# EAGLE board PCB_ICBExt-R1.0-J23 (EAGLE 6.6.0), part 1 of 2
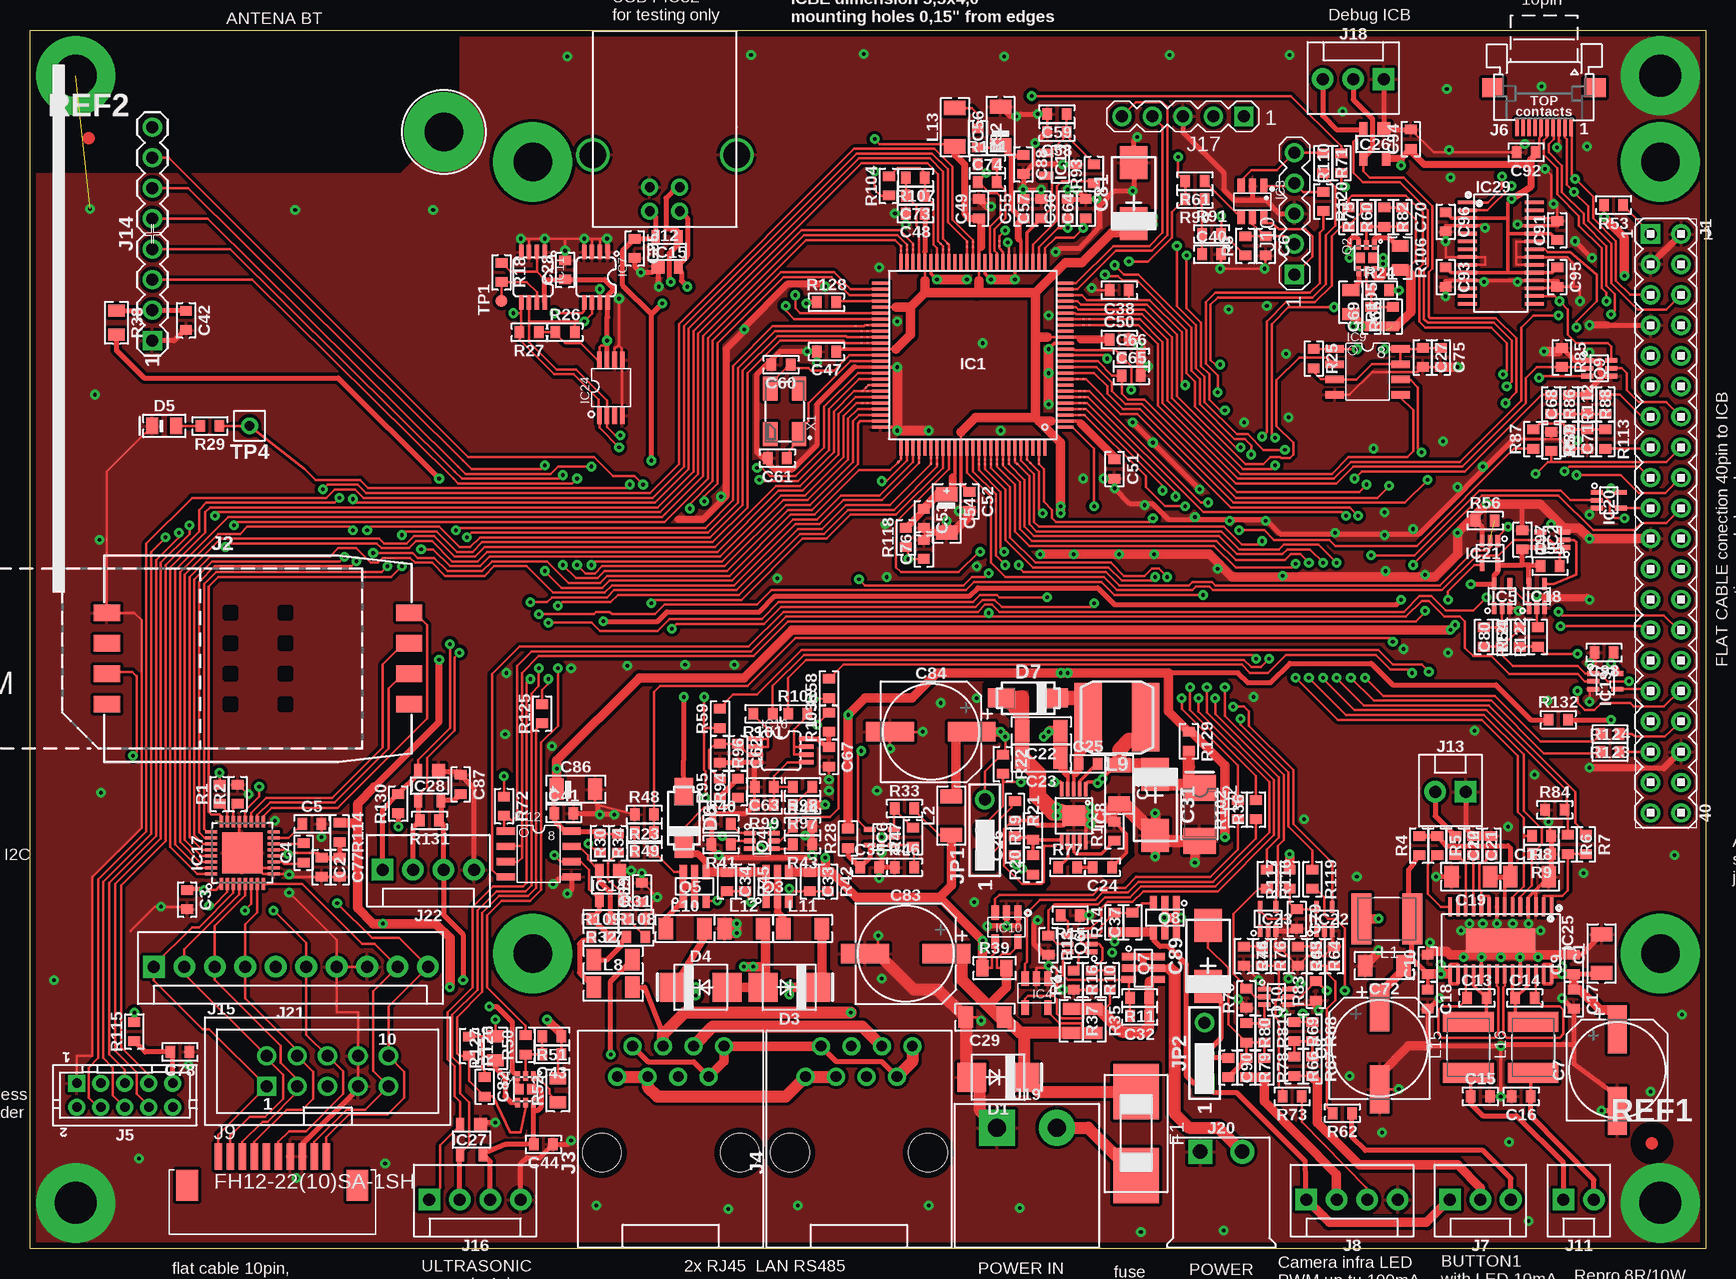
[diagram p7: board, top side]
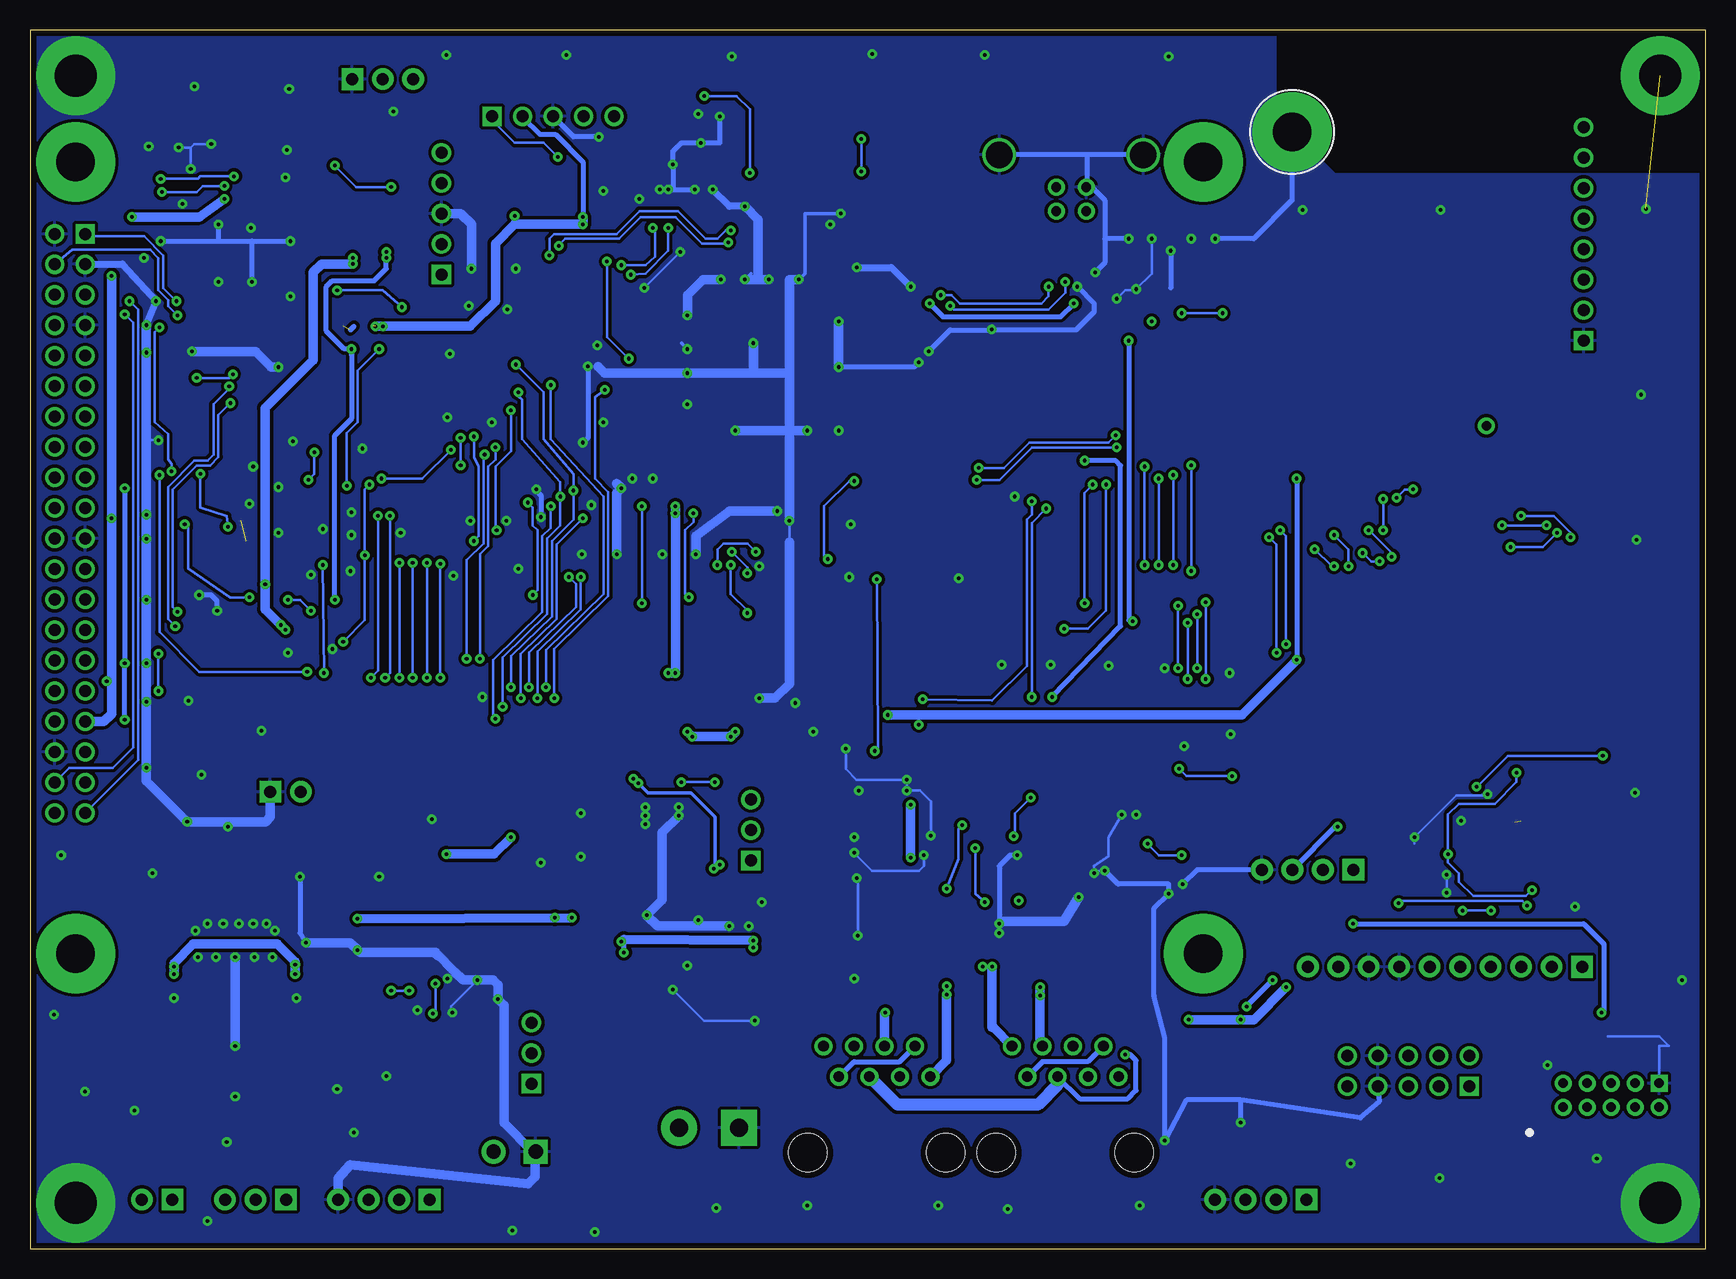
[diagram p8: board, bottom side, seen from below]

Size 139.7 x 101.6 mm. Coordinates in mm from the lower left corner, seen from the top.
Copper layers (1*16): Top 0.035mm / dielectric 1.5mm / Bottom 0.035mm
Design rules "default *": minimum track width 0.2mm, minimum drill 0.3mm, track to track 0.2mm, track to pad 0.2mm, pad to pad 0.2mm, via to via 0.2mm, smd to smd 0.001mm, copper to edge 0.49mm, drill to drill 0.2mm, minimum pad ring 0.3mm, minimum via ring 0.25mm, stop-mask expansion 0.1mm, vias tented up to drill 0.6mm, thermal gap 0.27mm
Net classes: 1 HV: clearance 0.3 mm to class 0
tRestrict: area 9.9,94.6 to 30.9,101.6; 34 lines
bRestrict: area 9.9,94.6 to 30.9,101.6

## Footprints (pad centres in the part's own frame; a part is rotated, then mirrored left to right if it is on the bottom)
1206 = smd 1.19 x 1.79: 1 -1.6,0; 2 1.6,0
0603 = smd 0.79 x 0.99: 1 -0.8,0; 2 0.8,0
CAP_8MM_DIA_SMT = smd 1.59 x 3.99: 1 0,3.4; 2 0,-3.4
CT-C = smd 2.743 x 2.311: + -2.54,0; - 2.54,0
1206-POL-C = smd 1.19 x 1.79: + -1.6,0; - 1.6,0
SMB = smd 2.4 x 2.4: A 2.2,0; C -2.2,0
SMA = smd 2.159 x 2.743: + -2.311,0.003; - 2.108,-0.002
0805-POL-D = smd 0.99 x 1.39: A 1,0; K -1,0
SMA' = smd 2.21 x 1.575: A -2.223,0; K 2.223,0
LITTLEFUSE0154 = smd 4.6 x 3.8: 1 3.5,0; 2 -3.5,0
TQFP100_14X14_0,5MM = smd 1.39 x 0.28: 1 -7.7,6; 2 -7.7,5.5; 3 -7.7,5; 4 -7.7,4.5; 5 -7.7,4; 6 -7.7,3.5; 7 -7.7,3; 8 -7.7,2.5; 9 -7.7,2; 10 -7.7,1.5; 11 -7.7,1; 12 -7.7,0.5; 13 -7.7,0; 14 -7.7,-0.5; 15 -7.7,-1; 16 -7.7,-1.5; 17 -7.7,-2; 18 -7.7,-2.5; 19 -7.7,-3; 20 -7.7,-3.5; 21 -7.7,-4; 22 -7.7,-4.5; 23 -7.7,-5; 24 -7.7,-5.5; 25 -7.7,-6; 51 7.7,-6; 52 7.7,-5.5; 53 7.7,-5; 54 7.7,-4.5; 55 7.7,-4; 56 7.7,-3.5; 57 7.7,-3; 58 7.7,-2.5; 59 7.7,-2; 60 7.7,-1.5; 61 7.7,-1; 62 7.7,-0.5; 63 7.7,0; 64 7.7,0.5; 65 7.7,1; 66 7.7,1.5; 67 7.7,2; 68 7.7,2.5; 69 7.7,3; 70 7.7,3.5; 71 7.7,4; 72 7.7,4.5; 73 7.7,5; 74 7.7,5.5; 75 7.7,6 | smd 0.28 x 1.39: 26 -6,-7.7; 27 -5.5,-7.7; 28 -5,-7.7; 29 -4.5,-7.7; 30 -4,-7.7; 31 -3.5,-7.7; 32 -3,-7.7; 33 -2.5,-7.7; 34 -2,-7.7; 35 -1.5,-7.7; 36 -1,-7.7; 37 -0.5,-7.7; 38 0,-7.7; 39 0.5,-7.7; 40 1,-7.7; 41 1.5,-7.7; 42 2,-7.7; 43 2.5,-7.7; 44 3,-7.7; 45 3.5,-7.7; 46 4,-7.7; 47 4.5,-7.7; 48 5,-7.7; 49 5.5,-7.7; 50 6,-7.7; 76 6,7.7; 77 5.5,7.7; 78 5,7.7; 79 4.5,7.7; 80 4,7.7; 81 3.5,7.7; 82 3,7.7; 83 2.5,7.7; 84 2,7.7; 85 1.5,7.7; 86 1,7.7; 87 0.5,7.7; 88 0,7.7; 89 -0.5,7.7; 90 -1,7.7; 91 -1.5,7.7; 92 -2,7.7; 93 -2.5,7.7; 94 -3,7.7; 95 -3.5,7.7; 96 -4,7.7; 97 -4.5,7.7; 98 -5,7.7; 99 -5.5,7.7; 100 -6,7.7
SC70-5,SOT353,TSSOP5 = smd 0.39 x 0.99: 1 -0.65,-1; 2 0,-1; 3 0.65,-1; 4 0.65,1; 5 -0.65,1
SOT23-6 = smd 0.6 x 1.2: 1 -0.95,-1.3; 2 0,-1.3; 3 0.95,-1.3; 4 0.95,1.3; 5 0.003,1.3; 6 -0.95,1.3
SOT23-5 = smd 0.6 x 1.2: 1 -0.95,-1.206; 2 0,-1.206; 3 0.95,-1.206; 4 0.95,1.206; 5 -0.95,1.206
SC-70-5 = smd 0.39 x 0.99: 1 -0.65,-1; 2 0,-1; 3 0.65,-1; 4 0.65,1; 5 -0.65,1
MSOP-08 = smd 0.38 x 1.2: 1 -1,-2.1; 2 -0.35,-2.1; 3 0.3,-2.1; 4 0.95,-2.1; 5 0.95,2.1; 6 0.3,2.1; 7 -0.35,2.1; 8 -1,2.1
MSOP10EXP = smd 0.3 x 1.2: 1 -1,-2.2; 2 -0.5,-2.2; 3 0,-2.2; 4 0.5,-2.2; 5 1,-2.2; 6 1,2.2; 7 0.5,2.2; 8 0,2.2; 9 -0.5,2.2; 10 -1,2.2 | smd 1.88 x 1.68: EP 0,0
SO-08 = smd 0.61 x 1.524: 1 -1.905,-2.743; 2 -0.635,-2.743; 3 0.635,-2.743; 4 1.905,-2.743; 5 1.905,2.743; 6 0.635,2.743; 7 -0.635,2.743; 8 -1.905,2.743
SO08 = smd 0.61 x 1.524: 1 -1.905,-2.743; 2 -0.635,-2.743; 3 0.635,-2.743; 4 1.905,-2.743; 5 1.905,2.743; 6 0.635,2.743; 7 -0.635,2.743; 8 -1.905,2.743
SOT23 = smd 0.69 x 1.19: 1 0.95,1.2; 2 -0.95,1.2; 3 0,-1.2
SOT-143 = smd 1.09 x 1.19: 1 -0.75,-1.2 | smd 0.69 x 1.19: 2 0.95,-1.2; 3 0.95,1.2; 4 -0.95,1.2
QFN32 = smd 0.99 x 0.28: 1 -2.6,1.75; 2 -2.6,1.25; 3 -2.6,0.75; 4 -2.6,0.25; 5 -2.6,-0.25; 6 -2.6,-0.75; 7 -2.6,-1.25; 8 -2.6,-1.75; 17 2.6,-1.75; 18 2.6,-1.25; 19 2.6,-0.75; 20 2.6,-0.25; 21 2.6,0.25; 22 2.6,0.75; 23 2.6,1.25; 24 2.6,1.75 | smd 0.28 x 0.99: 9 -1.75,-2.6; 10 -1.25,-2.6; 11 -0.75,-2.6; 12 -0.25,-2.6; 13 0.25,-2.6; 14 0.75,-2.6; 15 1.25,-2.6; 16 1.75,-2.6; 25 1.75,2.6; 26 1.25,2.6; 27 0.75,2.6; 28 0.25,2.6; 29 -0.25,2.6; 30 -0.75,2.6; 31 -1.25,2.6; 32 -1.75,2.6 | smd 3.4 x 3.4: PAD 0,0
TSSOP08-3 = smd 0.38 x 1.4: 1 -0.94,-2.343; 2 -0.305,-2.343; 3 0.33,-2.343; 4 0.965,-2.343; 5 0.965,2.292; 6 0.33,2.292; 7 -0.305,2.292; 8 -0.94,2.292
TSSOP28_EP = smd 1.59 x 0.3: 1 -2.8,4.225; 2 -2.8,3.575; 3 -2.8,2.925; 4 -2.8,2.275; 5 -2.8,1.625; 6 -2.8,0.975; 7 -2.8,0.325; 8 -2.8,-0.325; 9 -2.8,-0.975; 10 -2.8,-1.625; 11 -2.8,-2.275; 12 -2.8,-2.925; 13 -2.8,-3.575; 14 -2.8,-4.225; 15 2.8,-4.225; 16 2.8,-3.575; 17 2.8,-2.925; 18 2.8,-2.275; 19 2.8,-1.625; 20 2.8,-0.975; 21 2.8,-0.325; 22 2.8,0.325; 23 2.8,0.975; 24 2.8,1.625; 25 2.8,2.275; 26 2.8,2.925; 27 2.8,3.575; 28 2.8,4.225 | smd 1.99 x 5.79: EP 0,0
TSSOP28 = smd 1.59 x 0.3: 1 -2.8,4.225; 2 -2.8,3.575; 3 -2.8,2.925; 4 -2.8,2.275; 5 -2.8,1.625; 6 -2.8,0.975; 7 -2.8,0.325; 8 -2.8,-0.325; 9 -2.8,-0.975; 10 -2.8,-1.625; 11 -2.8,-2.275; 12 -2.8,-2.925; 13 -2.8,-3.575; 14 -2.8,-4.225; 15 2.8,-4.225; 16 2.8,-3.575; 17 2.8,-2.925; 18 2.8,-2.275; 19 2.8,-1.625; 20 2.8,-0.975; 21 2.8,-0.325; 22 2.8,0.325; 23 2.8,0.975; 24 2.8,1.625; 25 2.8,2.275; 26 2.8,2.925; 27 2.8,3.575; 28 2.8,4.225
MA20-2 = drill 1 pad 1.6 square: 1 -24.13,-1.27 | drill 1 pad 1.6: 2 -24.13,1.27; 3 -21.59,-1.27; 4 -21.59,1.27; 5 -19.05,-1.27; 6 -19.05,1.27; 7 -16.51,-1.27; 8 -16.51,1.27; 9 -13.97,-1.27; 10 -13.97,1.27; 11 -11.43,-1.27; 12 -11.43,1.27; 13 -8.89,-1.27; 14 -8.89,1.27; 15 -6.35,-1.27; 16 -6.35,1.27; 17 -3.81,-1.27; 18 -3.81,1.27; 19 -1.27,-1.27; 20 -1.27,1.27; 21 1.27,-1.27; 22 1.27,1.27; 23 3.81,-1.27; 24 3.81,1.27; 25 6.35,-1.27; 26 6.35,1.27; 27 8.89,-1.27; 28 8.89,1.27; 29 11.43,-1.27; 30 11.43,1.27; 31 13.97,-1.27; 32 13.97,1.27; 33 16.51,-1.27; 34 16.51,1.27; 35 19.05,-1.27; 36 19.05,1.27; 37 21.59,-1.27; 38 21.59,1.27; 39 24.13,-1.27; 40 24.13,1.27
CCM03-3504LFT-JK = smd 2.2 x 1.4: C1 12.6,3.81; C2 12.6,1.27; C3 12.6,-1.27; C4 12.6,-3.81; C5 -12.6,3.81; C6 -12.6,1.27; C7 -12.6,-1.27; C8 -12.6,-3.81
RJ8-8-90-DOWN = drill 0.9 pad 1.4: 1 -4.445,6.35; 2 -3.175,8.89; 3 -1.905,6.35; 4 -0.635,8.89; 5 0.635,6.35; 6 1.905,8.89; 7 3.175,6.35; 8 4.445,8.89 | hole 3.2: 5.75,0; -5.75,0
DF11-10DP-2DSA = drill 0.8 pad 1.3 square: 1 4,-1 | drill 0.8 pad 1.3: 2 4,1; 3 2,-1; 4 2,1; 5 0,-1; 6 0,1; 7 -2,-1; 8 -2,1; 9 -4,-1; 10 -4,1
FH12A-10S-05SH = smd 0.3 x 1.5: 1 -2.25,2.8; 2 -1.75,2.8; 3 -1.25,2.8; 4 -0.75,2.8; 5 -0.25,2.8; 6 0.25,2.8; 7 0.75,2.8; 8 1.25,2.8; 9 1.75,2.8; 10 2.25,2.8 | smd 1.8 x 1.6: C1 -4.25,-0.5; C2 4.25,-0.5
3-641215-3 = drill 1 pad 1.8 square: 1 2.54,0 | drill 1 pad 1.8: 2 0,0; 3 -2.54,0
3-641215-4 = drill 1 pad 1.8 square: 1 3.81,0 | drill 1 pad 1.8: 2 1.27,0; 3 -1.27,0; 4 -3.81,0
CON-FPC-1.0MM-10POS = smd 0.6 x 2.2: 1 -4.5,0; 2 -3.5,0; 3 -2.5,0; 4 -1.5,0; 5 -0.5,0; 6 0.5,0; 7 1.5,0; 8 2.5,0; 9 3.5,0; 10 4.5,0 | smd 1.8 x 2.6: P$1 -7.1,-2.4; P$2 7.1,-2.4
MA05-1 = drill 1 pad 1.6 square: 1 -5.08,0 | drill 1 pad 1.6: 2 -2.54,0; 3 0,0; 4 2.54,0; 5 5.08,0
3-641215-2 = drill 1 pad 1.8 square: 1 1.27,0 | drill 1 pad 1.8: 2 -1.27,0
USB_B_90 = drill 0.8 pad 1.4: 1_+5V 1.25,4.7; 2_D- -1.25,4.7; 3_D+ -1.25,2.7; 4_GND 1.25,2.7 | drill 2.2 pad 2.8: SH1 -6,0; SH2 6,0
MA08-1-MALE = drill 1 pad 1.6 square: 1 -8.89,0 | drill 1 pad 1.6: 2 -6.35,0; 3 -3.81,0; 4 -1.27,0; 5 1.27,0; 6 3.81,0; 7 6.35,0; 8 8.89,0
MLW10G-5X2 = drill 1 pad 1.6 square: 1 -5.08,-1.27 | drill 1 pad 1.6: 2 -5.08,1.27; 3 -2.54,-1.27; 4 -2.54,1.27; 5 0,-1.27; 6 0,1.27; 7 2.54,-1.27; 8 2.54,1.27; 9 5.08,-1.27; 10 5.08,1.27
796644-2-5MM = drill 1.5 pad 3 square: 1 2.5,0 | drill 1.5 pad 3: 2 -2.5,0
284512-2-3,5MM = drill 1.2 pad 2 square: 1 1.75,0 | drill 1.2 pad 2: 2 -1.75,0
4-641215-0 = drill 1 pad 1.8 square: 1 11.38,0 | drill 1 pad 1.8: 2 8.84,0; 3 6.3,0; 4 3.76,0; 5 1.22,0; 6 -1.32,0; 7 -3.86,0; 8 -6.4,0; 9 -8.94,0; 10 -11.48,0
JP3CLOSE12 = drill 1 pad 1.626 square: 1 -2.54,0 | drill 1 pad 1.626: 2 0,0; 3 2.54,0
L1812 = smd 1.66 x 4.22: 1 -2.12,0; 2 2.12,0
NR6028 = smd 2.3 x 5.7: 1 2.4,0; 2 -2.4,0
TEMP-PAD = smd 0.2 x 0.2: P$1 0,0
PCB-ICBE = drill 3.5 pad 6.6: 1 -3.01,-17.79; 2 -135.09,-17.79; 3 -135.09,76.19; 4 -3.01,76.19
PCB-ICB = drill 3.2 pad 6.6: 1 -3,3; 2 -97,3; 3 -97,69; 4 -3,69
BT_MODULE_BRD = drill 3.2 pad 6.6: 1 25.5,20.5
MICRO_FET = smd 0.4 x 0.8: 1 -0.65,-1.1; 2 0,-1.1; 3 0.65,-1.1; 4 0.65,1.1; 5 0,1.1; 6 -0.65,1.1 | smd 0.7 x 0.86: P1 -0.5,0; P2 0.5,0
SSOT-6 = smd 0.6 x 1.2: 1 -0.95,-1.2; 2 0,-1.2; 3 0.95,-1.206; 4 0.95,1.2; 5 0,1.2; 6 -0.95,1.2
SC70-6 = smd 0.39 x 0.99: 1 -0.65,-1; 2 0,-1; 3 0.65,-1; 4 0.65,1; 5 0,1; 6 -0.65,1
0805 = smd 0.99 x 1.39: 1 -1,0; 2 1,0
SMD_ROUND_1MM = smd 1 x 1: P$1 0,0
TH_ROUND_14MM08MM = drill 0.8 pad 1.4: P$1 0,0
7B = smd 2 x 1.2: 1 -1.9,-1.2; 2 1.9,-1.2; 3 1.9,1.2; 4 -1.9,1.2

## Placement (x,y rotation side)
C1  4u7/50  [1206]  131,24.6 90 top
C2  100n  [0603]  24.3,31.8 270 top
C3  10u  [0603]  13.1,29.1 270 top
C4  1u/10  [0603]  22.8,33 90 top
C5  4u7/6.3  [0603]  23.5,35.4 0 top
C6  10u  [0603]  103,83.6 270 top
C7  220u/25V  [CAP_8MM_DIA_SMT]  132.3,14.9 0 top
C8  220u/25V  [CAP_8MM_DIA_SMT]  112.5,16.7 0 top
C9  1n  [0603]  128.7,23.7 90 top
C10  1n  [0603]  116.5,23.7 90 top
C11  4u7/50  [1206]  125,31 0 top
C12  1u/25  [0603]  121.8,33.6 90 top
C13  470n  [0603]  120.6,20.9 0 top
C14  470n  [0603]  124.6,20.9 0 top
C15  1n  [0603]  120.9,12.7 0 top
C16  1n  [0603]  124.3,12.7 180 top
C17  100n  [0603]  128.7,20.8 270 top
C18  100n  [0603]  116.5,20.8 270 top
C19  4u7/50  [1206]  120.1,31 180 top
C20  1u/25  [0603]  118.8,33.6 270 top
C21  1u/25  [0603]  120.3,33.6 270 top
C22  4u7/50  [1206]  84.3,43.2 180 top
C23  4u7/50  [1206]  84.3,40.9 180 top
C24  1n  [0603]  89.4,31.8 180 top
C25  470n/25  [0603]  88.2,40.4 0 top
C26  10p  [0603]  82.1,33.6 90 top
C27  100n  [0603]  116.1,74.3 270 top
C28  100n  [0603]  44.6,81.6 90 top
C29  4u7/50  [1206]  79.6,19.3 180 top
C30  47u/6.3  [1206]  90.8,38.7 270 top
C31  47uTC  [CT-C]  93.8,37 270 top
C32  100n  [0603]  92.5,19.4 180 top
C33  100n  [0603]  65,30.6 270 top
C34  1n  [0603]  58.1,30.6 270 top
C35  1u  [0603]  70,31.8 0 top
C36  100n  [0603]  86.5,86.7 90 top
C37  1n  [0603]  91.9,27.2 90 top
C38  10n  [0603]  90.8,79.9 180 top
C39  100n  [0603]  51,29.7 90 top
C40  100n  [0603]  98.5,82.9 0 top
C41  100n  [0603]  44.5,36.3 0 top
C42  10u  [0603]  13,77.4 270 top
C43  1n  [0603]  43.5,16.2 180 top
C44  10u  [0603]  42.8,8.7 180 top
C45  100n  [0603]  105.7,24.4 270 top
C46  100n  [0603]  101.2,24.4 270 top
C47  100n  [0603]  66.4,74.8 180 top
C48  1u  [0603]  73.8,86.3 180 top
C49  100n  [0603]  79.1,86.7 90 top
C50  1u  [0603]  90.8,75.8 0 top
C51  100n  [0603]  90.4,65 270 top
C52  1u  [0603]  78.3,62.3 270 top
C53  10u  [0603]  74.5,60.9 270 top
C54  10uTA  [1206-POL-C]  76.4,61.3 270 top
C55  100n  [0603]  82.8,86.7 90 top
C56  10uTA  [1206-POL-C]  80.9,93.6 90 top
C57  10n  [0603]  84.3,86.7 90 top
C58  100n  [0603]  85.6,93.1 180 top
C59  100n  [0603]  85.6,94.6 180 top
C60  18p  [0603]  62.6,73.7 180 top
C61  18p  [0603]  62.3,65.9 180 top
C62  1n  [0603]  59,41.3 270 top
C63  1n  [0603]  61.2,38.5 180 top
C64  100n  [0603]  88,86.7 90 top
C65  1n  [0603]  91.8,72.8 0 top
C66  10n  [0603]  91.8,74.3 0 top
C67  10u  [0603]  66.6,41 270 top
C68  1n  [0603]  128.3,70.4 90 top
C69  1n  [0603]  111.8,77.7 90 top
C70  1n  [0603]  114.4,86 270 top
C71  1n  [0603]  128.3,67.5 270 top
C72  4u7/50  [1206]  112.9,23.6 180 top
C73  10n  [0603]  73.8,87.8 180 top
C74  10n  [0603]  79.8,88.9 0 top
C75  100n  [0603]  117.6,74.3 270 top
C76  10n  [0603]  74.5,58.3 90 top
C77  10u  [0603]  25.8,31.8 270 top
C78  10u  [0603]  12.5,16.4 180 top
C79  10u  [0603]  105.6,27.5 270 top
C80  10n  [0603]  122.7,51 90 top
C81  47uTC  [CT-C]  92,88 90 top
C82  1n  [0603]  37.9,13.5 270 top
C83  220u/25V  [CAP_8MM_DIA_SMT]  73,24.6 270 top
C84  220u/25V  [CAP_8MM_DIA_SMT]  75.1,43.1 270 top
C85  100n  [0603]  50.4,83.4 270 top
C86  10uTA  [1206-POL-C]  45.5,38.3 0 top
C87  10u  [0603]  35.9,38.7 270 top
C88  10u  [0603]  82.8,90.4 270 top
C89  47uTC  [CT-C]  98.2,24.4 90 top
C90  100n  [0603]  99.9,15.1 270 top
C91  10n  [0603]  127.3,84.9 90 top
C92  10u  [0603]  124.7,91.4 180 top
C93  100n  [0603]  118,81 270 top
C94  100n  [0603]  115.1,92.5 90 top
C95  10n  [0603]  127.3,81 270 top
C96  10n  [0603]  118,85.6 270 top
C97  1u  [0603]  124.4,59.1 270 top
C98  10u  [0603]  131.2,49.7 180 top
D1  P6SMB20A  [SMB]  80.7,14.3 180 top
D2  SMLVT3V3  [SMA]  97.5,36.1 270 top
D3  P6SMB20A  [SMB]  63.3,21.8 180 top
D4  P6SMB20A  [SMB]  55.9,21.8 0 top
D5  LED-GREEN  [0805-POL-D]  11.2,68.6 0 top
D6  SS14  [SMA']  54.5,35.9 270 top
D7  SS14  [SMA']  83.2,45.9 0 top
F1  T2A-LITTLEFUSE0154  [LITTLEFUSE0154]  92.2,9.6 270 top
IC1  PIC32MX470F512L-I/PF  [TQFP100_14X14_0,5MM]  78.6,74.5 180 top
IC2  AHC1G08  [SC70-5,SOT353,TSSOP5]  126.9,59.1 90 top
IC3  PIC10F200T-I/OT  [SOT23-6]  101.9,87.3 180 top
IC4  MAX9938HEUK+T  [SOT23-5]  83.9,21.3 180 top
IC5  AHC1G14  [SC70-5,SOT353,TSSOP5]  122.7,54.4 0 top
IC6  MIC841LYC  [SC-70-5]  71,34.3 90 top
IC7  24LC32A-I/MS  [MSOP-08]  47.15,81 180 top
IC8  LT3971EMSE  [MSOP10EXP]  87,36.1 180 top
IC9  AT25SF321-SSHD  [SO-08]  111.5,73.1 270 top
IC10  MAX9938HEUK+T  [SOT23-5]  81.4,26.8 180 top
IC11  24LC32A-I/MS  [MSOP-08]  41.9,81 180 top
IC12  SN65HVD12D  [SO08]  42.4,32.9 270 top
IC13  REF3025  [SOT23]  85.9,90.4 90 top
IC14  TPD2E001DZDR  [SOT-143]  48.4,30.3 180 top
IC15  TPD2E001DZDR  [SOT-143]  53.1,83.1 0 top
IC16  MCP6042-I/MS  [MSOP-08]  62.6,41.5 270 top
IC17  LTC1955  [QFN32]  17.7,33 90 top
IC18  AHC1G32  [SC70-5,SOT353,TSSOP5]  125.6,54.4 0 top
IC19  AHC1G08  [SC70-5,SOT353,TSSOP5]  131.3,47.3 270 top
IC20  AHC1G08  [SC70-5,SOT353,TSSOP5]  131.6,62.4 270 top
IC21  AHC1G32  [SC70-5,SOT353,TSSOP5]  121.7,58 180 top
IC22  AHC1G14  [SC70-5,SOT353,TSSOP5]  107.9,27.5 0 top
IC23  AHC1G14  [SC70-5,SOT353,TSSOP5]  103.2,27.5 0 top
IC24  LM75ADP  [TSSOP08-3]  48.4,71.8 0 top
IC25  TPA3111D1PWP  [TSSOP28_EP]  122.6,25.7 270 top
IC26  TPD2E001DZDR  [SOT-143]  112.1,92.1 180 top
IC27  TPD2E001DZDR  [SOT-143]  36.8,9.1 180 top
IC28  TPD2E001DZDR  [SOT-143]  33.3,38.6 180 top
IC29  AT97SC3205T-U3A1C20B  [TSSOP28]  122.6,83 0 top
J1  MA20-2-ICB-EXT  [MA20-2]  136.36,60.47 270 top
J2  CCM03-3504LFT-JK  [CCM03-3504LFT-JK]  19,49.2 0 top
J3  RJ8-8-90-DOWN  [RJ8-8-90-DOWN]  53.4,8 0 top
J4  RJ8-8-90-DOWN  [RJ8-8-90-DOWN]  69.1,8 0 top
J5  DF11-10DP-2DSA(01)  [DF11-10DP-2DSA]  7.9,12.8 180 top
J6  FH12A-10S-05SH  [FH12A-10S-05SH]  126.2,96.3 180 top
J7  3-641215-3  [3-641215-3]  120.9,4.1 180 top
J8  3-641215-4  [3-641215-4]  110.2,4.1 180 top
J9  FH12-22(10)SA-1SH  [CON-FPC-1.0MM-10POS]  20.2,7.7 0 top
J10  DNP-open-hole  [MA05-1]  105.4,86.3 90 top
J11  3-641215-2  [3-641215-2]  129.1,4.1 180 top
J12  USB_B_180  [USB_B_90]  52.9,91.2 180 top
J13  3-641215-2  [3-641215-2]  118.4,38.1 0 top
J14  pin1x8  [MA08-1-MALE]  10.2,84.6 90 top
J15  MLW10G  [MLW10G-5X2]  24.8,14.8 0 top
J16  3-641215-4  [3-641215-4]  37.1,4.1 180 top
J17  DNP-open-hole  [MA05-1]  96.1,94.4 180 top
J18  3-641215-3  [3-641215-3]  110.3,97.5 0 top
J19  796644-2(5mm)  [796644-2-5MM]  83.1,10.1 180 top
J20  284512-2(3.5MM)  [284512-2-3,5MM]  99.3,8.1 180 top
J21  4-641215-0  [4-641215-0]  21.7,23.5 180 top
J22  3-641215-4  [3-641215-4]  33.2,31.6 180 top
JP1  JP3CLOSE12  [JP3CLOSE12]  79.6,34.9 90 top
JP2  JP3CLOSE12  [JP3CLOSE12]  97.9,16.3 90 top
L1  HI1812V101R-10  [L1812]  113.1,27.5 180 top
L2  HI1206T500R  [1206]  76.8,36.1 90 top
L7  HI1206T500R  [1206]  48.6,24.1 0 top
L8  HI1206T500R  [1206]  48.6,21.8 0 top
L9  NR6028T4R7M  [NR6028]  90.6,44.3 180 top
L10  HI1206T500R  [1206]  54.6,26.7 0 top
L11  HI1206T500R  [1206]  64.4,26.7 0 top
L12  HI1206T500R  [1206]  59.5,26.7 0 top
L13  LQM31PN3R3M00L  [1206]  77.1,93.5 90 top
L15  HI1812V101R-10  [L1812]  119.9,16.8 90 top
L16  HI1812V101R-10  [L1812]  125.3,16.8 90 top
O1  PIC-RPX  [TEMP-PAD]  87.5,69.5 0 top
O2  PIC-RPX  [TEMP-PAD]  87.5,71 90 top
O3  PIC-OUT  [TEMP-PAD]  82.1,65.8 0 top
O4  PIC-OUT  [TEMP-PAD]  81.6,65.8 0 top
O5  PIC-RPX  [TEMP-PAD]  87.3,72.5 90 top
O6  PIC-OUT  [TEMP-PAD]  87.5,70.5 0 top
O7  PIC-OUT  [TEMP-PAD]  87.5,70 0 top
O8  PIC-RPX  [TEMP-PAD]  84.1,65.8 180 top
O9  PIC-OUT  [TEMP-PAD]  81.1,65.8 0 top
O10  PIC-RPX  [TEMP-PAD]  87.8,77 90 top
O11  PIC-RPX  [TEMP-PAD]  87.8,77.5 90 top
O12  PIC-OUT  [TEMP-PAD]  80.6,65.8 0 top
O13  PIC-OUT  [TEMP-PAD]  80.1,65.8 0 top
O14  PIC-RPX  [TEMP-PAD]  79.6,65.8 0 top
O15  PIC-RPX  [TEMP-PAD]  79.1,65.8 0 top
O16  PIC-RPX  [TEMP-PAD]  75.6,65.9 0 top
O17  PIC-OUT  [TEMP-PAD]  78.6,83.5 90 top
O18  PIC-RPX  [TEMP-PAD]  78.1,83.5 90 top
O19  PIC-RPX  [TEMP-PAD]  69.8,76.5 0 top
O20  PIC-RPX  [TEMP-PAD]  73.1,83.3 90 top
O21  PIC-RPX  [TEMP-PAD]  72.6,83.2 90 top
O22  PIC-RPX  [TEMP-PAD]  75.1,65.4 0 top
O23  PIC-OUT  [TEMP-PAD]  87.9,71.5 0 top
O24  PIC-RPX  [TEMP-PAD]  69.8,70.5 0 top
O25  PIC-RPX  [TEMP-PAD]  69.8,71.5 0 top
O26  PIC-RPX  [TEMP-PAD]  69.9,72 0 top
O27  PIC-RPX  [TEMP-PAD]  74.1,65.9 0 top
O28  PIC-RPX  [TEMP-PAD]  69.8,77 0 top
O29  PIC-OUT  [TEMP-PAD]  83.4,65.5 0 top
O35  PIC-RPX  [TEMP-PAD]  72.6,65.9 90 top
O39  PIC-OUT  [TEMP-PAD]  69.8,75.5 90 top
O40  PIC-OUT  [TEMP-PAD]  69.8,76 90 top
O53  PIC-RPX  [TEMP-PAD]  76.1,83.3 0 top
O55  PIC-OUT  [TEMP-PAD]  76.6,83.3 0 top
O58  PIC-OUT  [TEMP-PAD]  73.6,83.3 0 top
O59  PIC-RPX  [TEMP-PAD]  81.6,83.4 0 top
O60  PIC-RPX  [TEMP-PAD]  80.8,83.6 0 top
PCB1  PCB-ICBE  [PCB-ICBE]  138.9,21.6 0 top
PCB2  NDP-PCB-ICB  [PCB-ICB]  138.9,21.6 0 top
PCB3  DNP-PCB-BT  [BT_MODULE_BRD]  9,72.6 0 top
Q1  SSM6P49NU,LFPZ  [MICRO_FET]  41.3,13.3 180 top
Q2  SSM6P49NU,LFPZ  [MICRO_FET]  111.4,82.6 180 top
Q3  Si3421DV  [SSOT-6]  62.3,30.2 0 top
Q4  FDG6303N  [SC70-6]  61,34 270 top
Q5  Si3421DV  [SSOT-6]  55.4,30.2 0 top
Q6  FDG6303N  [SC70-6]  87.5,25.4 90 top
Q7  Si3421DV  [SSOT-6]  92.8,23.4 270 top
Q8  Si3421DV  [SSOT-6]  94.6,27.6 180 top
Q9  FDG6303N  [SC70-6]  130.8,73.4 270 top
Q10  FDG6303N  [SC70-6]  103.9,21 270 top
R1  300k  [0603]  15.8,37.9 90 top
R2  0R  [0603]  17.3,37.9 90 top
R3  100R  [0603]  101.3,83.6 90 top
R4  10R  [0603]  115.8,33.6 90 top
R5  100k??  [0603]  117.3,33.6 270 top
R6  100k  [0603]  128.2,33.7 270 top
R7  100k  [0603]  129.7,33.7 270 top
R8  100k  [0603]  126,34.4 180 top
R9  100k  [0603]  126,32.9 180 top
R10  1M  [0603]  88.5,22.4 270 top
R11  1M  [0603]  92.5,20.9 180 top
R12  300k  [0603]  87,22.4 90 top
R13  1M  [0603]  84.9,25.3 270 top
R14  1M  [0603]  90.4,27.2 90 top
R15  300k  [0603]  86.7,27.8 180 top
R16  1M  [0603]  90,22.4 90 top
R17  47k  [0603]  90.4,34.8 90 top
R18  10k  [0603]  39.3,81.4 270 top
R19  560k  [0603]  83.6,34.9 90 top
R20  1M  [0603]  83.6,32 90 top
R21  1M  [0603]  82.1,36.5 270 top
R22  4M99  [0603]  81.1,40.4 270 top
R23  0R/1M  [0603]  51.2,33.1 0 top
R24  100k  [0603]  112.5,79.9 0 top
R25  1M  [0603]  107,74.2 270 top
R26  10k  [0603]  44.6,76.4 0 top
R27  10k  [0603]  41.6,76.4 180 top
R28  100R  [0603]  68.2,34.2 90 top
R29  300R  [0603]  15,68.6 180 top
R30  1M  [0603]  49,33.8 90 top
R31  1M  [0603]  50.5,27.5 0 top
R32  1M  [0603]  47.6,27.5 180 top
R33  1M  [0603]  72.9,36.7 0 top
R34  1M  [0603]  47.5,33.8 270 top
R35  0.025R  [0805]  88.7,19 270 top
R36  1k  [0603]  102.2,36.6 90 top
R37  0.025R  [0805]  86.8,19 270 top
R38  1R  [0805]  7.2,77.2 270 top
R39  0.025R  [0805]  80.4,23.4 0 top
R40  300k  [0603]  57.6,35.4 0 top
R41  300k  [0603]  57.6,33.7 180 top
R42  1M  [0603]  66.5,30.6 270 top
R43  300k  [0603]  64.4,33.7 180 top
R44  300k  [0603]  64.4,35.2 0 top
R45  1M  [0603]  59.6,30.6 270 top
R46  150k  [0603]  72.9,31.8 0 top
R47  47k  [0603]  73.6,34.3 90 top
R48  1M  [0603]  51.2,36.2 0 top
R49  1M  [0603]  51.2,34.7 180 top
R50  100k  [0603]  41.3,17 90 top
R51  1M  [0603]  43.5,17.7 180 top
R52  1R  [0805]  44,13.2 90 top
R53  10k  [0603]  132,87 180 top
R54  300k-DNP?  [0603]  124.2,51 90 top
R55  100k  [0603]  126.7,56.9 0 top
R56  100k  [0603]  121.3,60.7 0 top
R57  100k  [0603]  126.8,67.3 270 top
R58  10k  [0603]  66.6,46.7 90 top
R59  10k  [0603]  57.5,44.2 90 top
R60  10k  [0603]  109.9,86 270 top
R61  100R  [0603]  97.1,89 180 top
R62  2k2  [0603]  109.4,11.3 180 top
R63  1k  [0603]  108.7,24.4 90 top
R64  300k  [0603]  107.2,24.4 270 top
R65  1M  [0603]  113.6,77.7 90 top
R66  1k  [0603]  105.4,15.2 270 top
R67  1k  [0603]  106.9,15.2 270 top
R68  1k  [0603]  106.9,18.1 270 top
R69  1k  [0603]  105.4,18.1 270 top
R70  1M  [0603]  101.4,20.9 90 top
R71  10k  [0603]  107.8,90.5 270 top
R72  100k  [0603]  39.5,36.9 270 top
R73  2k2  [0603]  105.2,12.7 180 top
R74  1k  [0603]  104.2,24.4 90 top
R75  10k  [0603]  111.4,86 90 top
R76  300k  [0603]  102.7,24.4 270 top
R77  47k  [0603]  86.5,31.8 0 top
R78  100R  [0603]  102.9,15.1 270 top
R79  100R  [0603]  101.4,15.1 270 top
R80  100R  [0603]  101.4,18 270 top
R81  100R  [0603]  102.9,18 270 top
R82  100k  [0603]  112.9,86 270 top
R83  1M  [0603]  107.2,21.5 90 top
R84  300k  [0603]  127.1,36.6 0 top
R85  1M  [0603]  127.7,74.3 270 top
R86  1k  [0603]  126.8,70.4 270 top
R87  1k  [0603]  125.3,67.5 90 top
R88  1M  [0603]  129.8,70.4 270 top
R89  1M  [0603]  129.8,67.5 90 top
R90  1k  [0603]  97.1,87.5 180 top
R91  10k  [0603]  98.5,84.6 0 top
R92  10R  [0603]  79,92.6 270 top
R93  300R  [0603]  88.7,89.6 90 top
R94  180k  [0603]  59,38.4 90 top
R95  4M99  [0603]  57.5,38.4 90 top
R96  560k  [0603]  57.5,41.3 270 top
R97  180k  [0603]  64.4,37 180 top
R98  4M99  [0603]  64.4,38.5 180 top
R99  560k  [0603]  61.2,37 180 top
R100  2k2  [0603]  64,44.6 0 top
R101  2k2  [0603]  61.1,44.6 180 top
R102  1k  [0603]  100.7,36.6 90 top
R103  300R  [0603]  66.6,43.9 90 top
R104  10k  [0603]  71.6,88.6 90 top
R105  1R  [0805]  110.1,78.9 270 top
R106  1R  [0805]  114.2,82.6 270 top
R107  10k  [0603]  73.8,89.3 180 top
R108  10R->1R->0R  [0603]  50.5,26 0 top
R109  10R->1R->0R  [0603]  47.6,26 0 top
R110  10k  [0603]  109.3,90.5 90 top
R111  10k  [0603]  79.8,90.4 0 top
R112  1k  [0603]  131.3,70.4 90 top
R113  1k  [0603]  131.3,67.5 270 top
R114  10R  [0603]  25.8,34.7 270 top
R115  10R  [0603]  8.7,18.1 90 top
R116  100R  [0603]  103.1,30.8 270 top
R117  100R  [0603]  105,30.8 90 top
R118  2k2  [0603]  73,59.3 90 top
R119  100R  [0603]  106.9,30.8 270 top
R120  10k  [0603]  107.8,87.3 270 top
R121  300k  [0603]  121.2,51 270 top
R122  1k  [0603]  125.7,51 90 top
R123  1k  [0603]  131.7,42.9 180 top
R124  1k  [0603]  131.7,41.4 0 top
R125  100k  [0603]  42.7,44.6 90 top
R126  1M  [0603]  36.6,16.9 270 top
R127  1R  [0805]  38.8,16.7 90 top
R128  10k  [0603]  66.4,78.9 0 top
R129  0R  [0603]  96.6,42.3 270 top
R130  10K  [0603]  30.7,37.1 90 top
R131  10K  [0603]  33.3,35.7 180 top
R132  100R  [0603]  127.4,44.1 0 top
REF1  REF  [REF]  135.2,8.8 0 top
REF2  REF  [REF]  4.9,92.6 0 top
T1  PIC-RPX  [TEMP-PAD]  69.3,76.5 0 top
T2  PIC-OUT  [TEMP-PAD]  80.1,65.4 0 top
T3  PIC-RPX  [TEMP-PAD]  87.5,71.5 90 top
T4  PIC-OUT  [TEMP-PAD]  78.6,83.9 90 top
T5  PIC-RPX  [TEMP-PAD]  68.8,76.9 0 top
T6  PIC-RPX  [TEMP-PAD]  78.1,83.9 90 top
T7  PIC-OUT  [TEMP-PAD]  83.1,65.8 0 top
T8  PIC-RPX  [TEMP-PAD]  73.6,83.7 90 top
T9  PIC-RPX  [TEMP-PAD]  72.6,83.6 90 top
T10  PIC-RPX  [TEMP-PAD]  75.9,83.8 0 top
T11  PIC-OUT  [TEMP-PAD]  76.5,83.8 90 top
T12  PIC-RPX  [TEMP-PAD]  69.4,71.5 90 top
T16  PIC-RPX  [TEMP-PAD]  69.7,71.8 90 top
T17  PIC-OUT  [TEMP-PAD]  69.3,75.5 90 top
T18  PIC-OUT  [TEMP-PAD]  72.4,65.6 90 top
T19  PIC-RPX  [TEMP-PAD]  74.1,65.5 90 top
T20  PIC-OUT  [TEMP-PAD]  69.3,76 90 top
T21  PIC-RPX  [TEMP-PAD]  69.4,70.5 90 top
T23  PIC-OUT  [TEMP-PAD]  75.1,65.9 90 top
T24  PIC-OUT  [TEMP-PAD]  75.6,65.4 90 top
T25  PIC-OUT  [TEMP-PAD]  79.6,65.4 90 top
T26  PIC-RPX  [TEMP-PAD]  87.9,71 90 top
T28  PIC-RPX  [TEMP-PAD]  87.8,72.5 90 top
T29  PIC-OUT  [TEMP-PAD]  84.1,65.4 90 top
T30  PIC-OUT  [TEMP-PAD]  87.9,69.5 90 top
T31  PIC-RPX  [TEMP-PAD]  87.9,70.5 90 top
T34  PIC-RPX  [TEMP-PAD]  87.9,70 90 top
T35  PIC-OUT  [TEMP-PAD]  80.6,65.4 90 top
T45  PIC-RPX  [TEMP-PAD]  79.1,65.4 180 top
T46  PIC-OUT  [TEMP-PAD]  81.1,65.4 90 top
T47  PIC-OUT  [TEMP-PAD]  81.6,65.4 90 top
T48  PIC-RPX  [TEMP-PAD]  82.3,65.4 90 top
T49  PIC-OUT  [TEMP-PAD]  81.6,83.1 270 top
T50  PIC-RPX  [TEMP-PAD]  80.8,84 90 top
T57  PIC-RPX  [TEMP-PAD]  73.1,83.7 0 top
T61  PIC-OUT  [TEMP-PAD]  88.3,77 0 top
T62  PIC-RPX  [TEMP-PAD]  88.3,77.5 0 top
TP1  DNP-TestPoint  [SMD_ROUND_1MM]  39.3,79 90 top
TP4  DNP-TestPoint  [TH_ROUND_14MM08MM]  18.3,68.6 180 top
X1  8MHz-5x3.2mm  [7B]  62.9,69.8 90 top

## Tracks (layer width: path | path; a pad name or v marks a point on that pad's centre or on a via)
3.3V2PWRON-ICB
  Top 0.2: J1.14 136.4,70.6 134.1,70.6 133.1,71.6 133.1,73 132.7,73.4 Q9.5
3.3V-BT
  Top 0.4: R38.1 10.15,78.2 J14.2 10.25,78.2 C42.1
+3,3V-FILT
  Top 0.4: R28.1 68.2,32.8 C35.1 70,32.6 IC6.5
+3.3V  (via drill 0.3 pad 0.7, 0.3 pad 0.8)  (2 unrouted)
  Top 0.2: R105.2 109.9,77.9 | R103.2 66.8,44.5 66.4,44.5 v65.6,43.7 | R52.2 44,15.9 C43.1 R51.1 | C70.1 R82.1 | 74.6,83.1 IC1.46 74.6,80.7 | 72.2,78.5 IC1.55 | 79.1,80.7 IC1.37 | 84.8,76 IC1.16 | 85.1,69 IC1.2 | 77.6,68.1 IC1.86 | 72.2,75 IC1.62 | 114.5,86.8 115.5,85.8 115.5,82.4 114.7,81.6 | C82.1 37.9,14.8 37.7,15 37.7,17.7 R127.2 | R127.2 R126.1 | R127.2 v38.8,19.1 | v99.3,86.1 R91.2 99.5,84.6 R3.1 | R104.1 70.9,87.8 70.4,88.3 v70.4,89.8 | v70.4,92.5 70.8,92.1 76.9,92.1 L13.1
  Top 0.28: IC1.62 67,75 C47.1 | 87.6,68.8 87.4,69 IC1.2 | 87.6,75.8 87.6,76 IC1.16 | IC1.37 79.1,83.5 79.3,83.5 | 79.3,85.5 79.3,85.9 C49.1 | IC1.86 77.6,63.8 C52.1
  Top 0.3: C69.1 111.9,76.9
  Top 0.4: v34.1,64.2 25.7,72.6 9.5,72.6 7.2,74.9 R38.2 | C48.1 74.6,83.1 | 94.9,48 100.7,48 101.5,47.2 103.4,47.2 105,48.8 111.8,48.8 113.6,47 122.2,47 125.1,44.1 R132.1 | v8.7,19.7 R115.2
  Top 0.6: 28.7,38.5 34.1,43.9 v34.1,49.1 | C70.1 114.5,86.8 | R106.2 114.7,81.6 | R65.1 113.9,76.9 | L13.1 77.1,91.2 77.9,90.4 77.9,86.3 78.3,85.9 C49.1
  Top 0.68: C51.1 90.4,66 87.6,68.8 | C50.1 87.6,75.8 | 79.3,83.5 79.3,85.5
  Top 0.8: R65.1 C69.1 111.1,76.9 R105.2 | 85.1,69 84.1,69 | 84.1,69 83.8,69.3 | 83.8,69.3 83.8,76 | 83.8,76 83.8,79.7 | 83.8,79.7 86.3,82.2 87.7,82.2 90.2,84.7 91.24,84.7 C81.+ 93.6,85.46 v93.6,85.4 v93.6,86 | 83.8,69.3 78.8,69.3 77.6,68.1 | 83.8,79.7 78.9,79.7 | 78.9,79.7 74.6,79.7 | 74.6,79.7 73.4,78.5 | 73.4,78.5 73.4,76.2 72.2,75 | 73.4,78.5 72.2,78.5 | 74.6,79.7 74.6,80.7 | 79.1,80.7 79.1,79.9 78.9,79.7 | 84.8,76 83.8,76 | 114.7,81.6 115.1,81.2 115.1,78.1 113.9,76.9 | R28.2 v68.2,44.5 69.6,45.9 73.5,45.9 75.6,48 v85.9,48 v86.5,48 94.9,48 94.9,44.8 R129.1 96.8,43.1 99.6,40.3 v99.6,34.3 | v35,21.8 35,25.9 33.8,27.1 v29.4,27.1 28.6,27.1 27.3,28.4 27.3,35.3 | R117.2 v105,32.9 | R51.1 44.3,17.9 v43.1,19.1 | 27.3,35.3 27.3,37.1 28.7,38.5 | R114.1 27.1,35.5 27.3,35.3 | 84.1,69 85.9,67.2 v85.9,61.9 v85.9,61.3 | v110.9,76.9 v110.3,76.9
  Bottom 0.2: v65.6,43.7 65.6,44.4 65.7,44.5 | v99.3,86.1 99.3,85.4 | v70.4,89.8 v70.4,92.5
  Bottom 0.4: J17.2 98.64,94.34 97.2,92.9 95.9,92.9 93.6,90.6 v93.6,86 | v34.1,64.2 v34.1,49.1 | v29.4,27.1 10.2,27.1 8.5,25.4 8.5,19.9 v8.7,19.7 | 113,76.6 112.7,76.9
  Bottom 0.8: v68.2,44.5 65.7,44.5 38.7,44.5 v34.1,49.1 | v43.1,19.1 v38.8,19.1 37.7,19.1 v35,21.8 | v105,32.9 101,32.9 v99.6,34.3 | v85.9,61.9 v85.9,61.3 v85.9,48 v86.5,48 | v93.6,86 v93.6,85.4 99.3,85.4 100.9,83.8 100.9,79 103,76.9 v110.3,76.9 v110.9,76.9
+3.3V-ULTRASONIC
  Top 0.4: Q1.P1 42.4,13.3 42.6,13.1 42.6,11.8 42.3,11.5 41.95,11.5 | Q1.6 41.95,11.5 | 41.95,11.5 41.95,9.15 42,9.1 C44.2 39.65,8.7 IC27.4 38.37,7.28 J16.3
+3.3V/1  (via drill 0.3 pad 0.7, 0.3 pad 0.8)
  Top 0.2: R26.1 43.7,76.4 | R27.1 43.7,76.4 | 43.7,76.4 44.6,75.5 45.9,75.5 47.31,74.09 IC24.8 47.46,75.16 47.6,75.3 48,75.3 | IC11.2 42.25,81.45 | 42.25,81.45 42.9,80.8 | R18.1 40.05,81.45 42.25,81.45 | IC7.8 48.15,77.75 | R25.2 107,73.1 107.6,72.5 108.72,72.5 IC9.3 110.56,72.47 111.84,73.73 IC9.7 IC9.8 115.9,75 | C27.1 C75.1 | 48,75.3 48.1,75.2 48.1,75.1 | v48.09,75.69 48.09,75.4 48,75.3
  Top 0.4: 110.75,82.6 Q2.P2 v110,82.6 v110,83.1 110,84.1 110.2,84.3 110.6,84.3 110.75,84.15 Q2.3 | IC11.8 42.9,80.8 C28.1 47.9,80.8 48.7,80 48.15,79.45 IC7.8 48.15,77.65 48.1,77.6 | v47.8,52.3 52.3,52.3 53.1,53.1 60.8,53.1 62.1,54.4 78.3,54.4 79,55.1 89,55.1 90.4,53.7 113.9,53.7 v114.3,54.1 | IC9.8 v112.91,75 v112.9,75 | 48.1,77.6 v48.1,75.7 v48.09,75.69 IC24.7 | 48.1,77.65 48.1,77.6 | 115.9,75 116.01,75 C27.1
  Bottom 0.2: v112.91,75 112.91,74.5 112.9,74.5
  Bottom 0.4: v48.1,75.7 48.1,52.4 v47.8,52.3 | v114.3,54.1 114.3,67.8 112.9,69.2 112.9,74.5 v112.9,75 | v112.91,75 113.51,75 115,76.5 115,80.2 114.5,80.7 111,80.7 110,81.7 v110,82.6
+3.3V/2  (via drill 0.3 pad 0.7)
  Top 0.2: R30.2 R34.1 | IC21.5 122.35,56.65 | R72.1 v39.5,39.4
  Top 0.4: Q2.P1 v112.8,82.6 v112.8,82.1 | Q2.6 112.05,81.05 112.2,80.9 112.6,80.9 | R34.1 47.3,34.8 IC12.8 44.6,34.8 43.7,35.7 C41.1 43.7,38.1 C86.+ | IC21.5 124.4,57 | 124.4,57 C97.2 124.4,58.45 IC2.5 | IC18.5 124.95,57 | 124.95,57 124.4,57 | 122.35,56.65 122.35,56.45 122.05,56.15 IC5.5 v120.1,55.4 | 124.95,57 125.8,57 R55.1
  Top 0.6: 112.6,80.9 112.8,81.1 v112.8,82.1
  Top 0.8: C86.+ v43.9,40 43.9,40.7 50.8,47.6 59.5,47.6 63.5,51.6 v118.4,51.6 v118.8,52
  Bottom 0.2: v39.5,39.4 43.3,39.4 v43.9,40
  Bottom 0.8: v112.8,82.1 115.4,82.1 116.1,81.4 116.1,74.1 120.1,70.1 v120.1,55.4 120.1,53.3 v118.8,52 v118.4,51.6
+3.3V/I2C  (via drill 0.3 pad 0.7)
  Top 0.4: Q1.P2 40.8,13.5 40.6,13.5 40.6,14.35 Q1.3 40.2,14.85 40.2,18.9 38.9,20.2 v38.3,20.2 | v36.1,22.4 36.1,26.2 34.47,27.83 J22.3 34.47,35.33 R131.1 34.25,35.85 IC28.4 35.4,37.4 C87.2 | R130.1 v30.7,35.2
  Bottom 0.4: v36.1,22.4 v38.3,20.2 | v30.7,35.2 30.87,35.2 J22.3
+3.3V/ICB  (via drill 0.3 pad 0.7)
  Top 0.2: J6.6 125.95,92.75 125.8,92.6 125.8,91.4 C92.1 | R54.2 124.2,51.6 124.1,51.6 C80.1 | v132.9,60.9 132.1,60.9 131.7,61.3 131.7,62.3 130.95,63.05 IC20.1 | R110.1 109.3,88.8 v109.6,88.5 | 131.2,86.7 R53.2 v131.2,86 | C80.1 122.7,49.5 123.6,48.6 129,48.6 129.65,47.95 IC19.1 130.85,47.95 131.5,47.3 v133.3,47.3 | C80.1 R121.2
  Top 0.3: v123.5,87.5 123.2,87.2 123.2,85.93 | 123.2,85.93 IC29.3 118.48,85.93 C96.1 | 123.2,84.62 IC29.24 126.78,84.62 C91.1 | 123.2,84.62 123.2,85.93 | 123.2,81.38 IC29.19 126.88,81.38 C95.1 | 123.2,81.38 123.2,84.62 | 123.2,81.38 IC29.10 118.43,81.38 C93.1
  Top 0.6: C92.1 125.5,91.2 125.1,90.8 125.1,90.4 | 125.1,90.4 125.1,88.5 v123.5,87.5 | 125.1,90.4 116.2,90.4 115.1,91.5 C94.1 114.3,90.9 | IC26.4 114.3,90.9 | v114.3,90.3 114.3,90.9
  Top 0.8: v132.9,81.1 132.9,84.3 v131.2,86
  Bottom 0.2: v109.6,88.5 112.5,88.5 v114.3,90.3
  Bottom 0.8: J1.33 133.54,43.96 132.9,44.6 132.9,47.3 | v133.3,47.3 132.9,47.3 | 132.9,47.3 v132.9,60.9 132.9,79.2 v132.9,81.1 | v131.2,86 125.6,86 v123.5,87.5
+3.3VCCR
  Top 0.4: J5.9 11.9,16.2 C78.2 9.6,16.4 R115.1
/3.3V1PWRON  (via drill 0.3 pad 0.7)
  Top 0.2: IC1.21 87.2,78.5 87.4,78.3 92.9,78.3 95.2,76 95.2,70.9 101.1,65 103.5,65 v103.8,65.3 | v103.8,67.6 103.5,67.9 103.5,77.1 104.9,78.5 v108.7,78.5 | R24.2 v114.1,79.9
  Bottom 0.2: v103.8,65.3 v103.8,67.6 | v114.1,79.9 110.3,79.9 v108.7,78.5
/3.3V2PWRON  (via drill 0.3 pad 0.7)
  Top 0.2: R75.2 109.9,85.3 R60.2 109.3,85.2 108.5,84.4 108.5,80.3 107.1,78.9 104.7,78.9 103.1,77.3 103.1,68.1 v102.7,67.7 | IC1.96 82.6,65.7 83.7,64.6 83.7,60.6 84.1,60.2 99.5,60.2 101,58.7 102.4,58.7 v102.7,59
  Bottom 0.2: v102.7,59 102.3,59.4 102.3,65.2 102.7,66 v102.7,67.7
/BTN1  (via drill 0.3 pad 0.8)
  Top 0.2: IC1.5 O6.P$1 T31.P$1 88.1,70.5 95.5,63.1 v95.5,62.7 | v99,71.4 99,72.8 98,73.8 98,78.9 98.8,79.7 106.7,79.7 107.5,80.5 107.5,84.7 107.8,85 R120.2 | IC22.4 108.55,32.15 105.3,35.4 105.3,39.9 101.6,43.6 101.6,44.8 101.2,45.2 v100.3,45.2
  Bottom 0.2: v99,71.4 99,71.1 98.7,70.8 98.7,67.5 95.5,63.9 v95.5,62.7 95.5,60.3 96.6,59.2 96.6,52.9 100.3,49.3 v100.3,45.2
/BTN2  (via drill 0.3 pad 0.7)
  Top 0.2: R71.2 107.8,89.5 108.8,88.5 108.8,85.3 108,84.5 108,80.4 106.9,79.3 99,79.3 98.4,78.7 98.4,74.1 98.8,73.7 v99.2,73.7 | v94.4,63.2 94.6,63.4 88,70 T34.P$1 O7.P$1 IC1.4 | v99.6,46.8 99.6,44.4 104.5,39.5 104.5,34.1 104,33.6 104,29.4 103.85,29.25 IC23.4
  Bottom 0.2: v99.2,73.7 96.9,71.4 96.9,67.5 94.4,64.6 v94.4,63.2 94.4,60.8 96.2,59 96.2,52.7 99.6,49.4 v99.6,46.8
/CL_CS  (via drill 0.3 pad 0.7)
  Top 0.2: J5.7 9.9,14.5 7.6,16.8 7.6,30.3 11.3,34 11.3,57 14.1,59.8 14.1,61.6 14.7,62.2 25.4,62.2 v25.8,62.6 | IC1.38 O17.P$1 T4.P$1 78.6,84.1 76.9,85.8 76.9,90.2 75.4,91.7 68.7,91.7 54.1,77.1 54.1,65.4 51.7,63 28,63 27.3,63.7 24.8,63.7 v24.4,63.3
  Bottom 0.2: v24.4,63.3 25.1,63.3 v25.8,62.6
/FAULT-AUDIO  (via drill 0.3 pad 0.7)
  Top 0.2: R7.1 129.7,34.6 128.8,35.5 128.8,38.1 121.6,45.3 111.2,45.3 v108.9,47.6 | IC1.95 O3.P$1 82.1,65.6 T48.P$1 83.3,64.4 83.3,60.4 83.9,59.8 99.3,59.8 100.8,58.3 104.1,58.3 104.5,58.7 107.4,58.7 v108.9,57.2
  Bottom 0.2: v108.9,57.2 v108.9,47.6
/FMEM1-CS  (via drill 0.3 pad 0.7)
  Top 0.2: IC1.11 88.9,73.5 90.2,72.2 90.2,71.5 91.3,70.4 92.7,70.4 100.5,62.6 112.3,62.6 v113.3,63.6 | R25.1 IC9.1 v110.6,75
  Bottom 0.2: v113.3,63.6 113.3,68 112.4,68.9 112.4,73.2 v110.6,75
/I2C_PWRON  (via drill 0.3 pad 0.7)
  Top 0.2: v84.4,61.3 84.1,61.6 84.1,64.8 O29.P$1 T7.P$1 IC1.97 | v84.8,54.3 80.8,54.3 80.6,54.5 79.2,54.5 78.6,53.9 62.4,53.9 61,52.5 53.3,52.5 52.3,51.5 47.5,51.5 46.8,52.2 v43.2,52.2 | v43.2,47.5 43.2,47.1 42.7,46.6 R125.2
  Bottom 0.2: v84.4,61.3 84.4,60.6 85.1,59.9 85.1,54.6 v84.8,54.3 | v43.2,52.2 v43.2,47.5
/INT-TOUCH  (via drill 0.3 pad 0.7)
  Top 0.2: J6.4 127,93.45 127,92.5 126.6,92.1 126.6,91.4 127.7,90.3 127.7,88.1 129.5,86.3 129.5,85.5 131.4,83.6 131.4,80.3 132.1,79.6 132.1,78.2 v131.8,77.9
  Bottom 0.2: J1.38 136.41,40.1 132.8,40.1 131.1,41.8 131.1,77.2 v131.8,77.9
/LD_SM  (via drill 0.3 pad 0.7)
  Top 0.2: IC17.25 14.75,34.75 14.5,35 14.5,55.4 15.5,56.4 29.3,56.4 v29.8,56.9 | v31,59.5 31.3,59.8 33.9,59.8 35.6,58.1 36.9,58.1 37.7,58.9 56.9,58.9 59.8,61.8 59.8,73 62.5,75.7 67.8,75.7 68,75.5 T17.P$1 O39.P$1 IC1.61
  Bottom 0.2: v29.8,56.9 29.8,58.3 v31,59.5
/MCLR  (via drill 0.3 pad 0.7)
  Top 0.2: IC1.13 89.5,74.5 v89.8,74.2 | v91.6,82.3 93.2,82.3 95.2,84.3 95.2,86.4 R90.2 R61.2 95.7,89.6 v95.7,91
  Bottom 0.2: v91.6,82.3 91.6,76 v89.8,74.2 | J17.1 101.18,94.08 99.3,92.2 96.9,92.2 v95.7,91
/MCLR2
  Top 0.2: IC3.6 102.85,85.75 103.1,85.5 103.5,85.5 104.1,85 106.3,85 106.9,84.4 106.9,82.72 J10.1
/RESET-ICB-OUT  (via drill 0.3 pad 0.7)
  Top 0.2: IC1.19 O11.P$1 T62.P$1 92.5,77.5 94.4,75.6 94.4,70.5 100.7,64.2 108.7,64.2 110.1,65.6 119.2,65.6 124.3,70.7 124.3,76.8 125.3,77.8 v127.4,77.8
  Bottom 0.2: v127.4,77.8 128.2,78.6 128.2,79.1 129,79.9 129,82.6 129.7,83.3 136.19,83.3 J1.4
/RESET-TOUCH  (via drill 0.3 pad 0.7)
  Top 0.2: J6.5 126.45,92.65 126.2,92.4 126.2,91.2 127.3,90.1 127.3,87.9 129.1,86.1 129.1,85.3 131,83.4 131,80.1 131.4,79.7 v131.4,79
  Bottom 0.2: J1.39 130.7,40.73 130.7,78.3 v131.4,79
/RST-IN  (via drill 0.3 pad 0.7)
  Top 0.2: R53.1 J1.1 | 125.6,79.4 IC29.16 125.62,79.4 127.1,79.4 127.43,79.08 127.43,79.03 v127.5,79 128.2,78.3 128.2,76.2 128.9,75.5 131.5,75.5 131.8,75.2 Q9.6
  Bottom 0.2: v127.5,79 128.6,80.1 128.6,82.8 130.2,84.4 134.89,84.4 J1.1
/SD-AUDIO  (via drill 0.3 pad 0.7)
  Top 0.2: R6.1 128.2,36.5 128.19,36.73 | 128.19,36.73 128.2,36.7 128.1,36.8 128.1,38.2 121.4,44.9 110.4,44.9 107.8,47.5 v107.8,47.6 | IC1.94 O4.P$1 T47.P$1 82.9,64.1 82.9,60.2 83.7,59.4 99.1,59.4 100.6,57.9 104.4,57.9 104.8,58.3 106.7,58.3 v107.8,57.2 | R84.2 128.06,36.6 128.19,36.73
  Bottom 0.2: v107.8,57.2 v107.8,47.6
/SM_FAULT  (via drill 0.3 pad 0.7)  (1 unrouted)
  Top 0.2: IC1.71 O24.P$1 T21.P$1 68.9,70.5 67.8,69.4 67.8,66 64.6,62.8 62.6,62.8 57.5,57.7 38.3,57.7 37.5,56.9 35,56.9 33.6,58.3 v32.6,58.3 | v31,56.9 30.1,56 15.7,56 14.9,55.2 14.9,36.4 15.1,36.2 15.8,36.2 15.95,36.05 IC17.24
  Bottom 0.2: v32.6,58.3 31.2,56.9 v31,56.9
/TWI_WAKEUP  (via drill 0.3 pad 0.7)
  Top 0.2: J1.17 135.02,64.28 134.1,65.2 128.3,65.2 v127.9,64.8 | v128.9,76.8 128.9,77.3 130.6,79 130.6,81.2 128.4,83.1 126.5,83.1 126.28,83.33 IC29.22
  Bottom 0.2: v127.9,64.8 127.9,65.4 128.2,65.8 128.2,67.9 129.3,68.9 129.3,76.4 v128.9,76.8
/USS_PWRON  (via drill 0.3 pad 0.7)
  Top 0.2: R50.2 41.3,18.6 38.1,21.8 38.1,27.8 39.3,29 41.7,29 42.6,29.9 42.6,42.2 44,43.6 v44,48.4 | v44,53.6 44.4,53.9 48.4,53.9 49,54.5 59.1,54.5 64.2,59.6 66.2,59.6 68.2,61.6 72,61.6 75.6,65.2 T24.P$1 O16.P$1 IC1.82
  Bottom 0.2: v44,48.4 v44,53.6
A+  (via drill 0.3 pad 0.7)
  Top 0.4: L8.2 51.23,21.8 52.77,17.87
  Top 1: J3.4 52.77,17.87 54.6,19.7 v68.4,19.7
  Bottom 0.8: J4.4 68.47,19.64 v68.4,19.7
A++  (via drill 0.3 pad 0.7)
  Top 0.2: IC14.3 46.6,29.95 46.6,31.6 45.94,32.27 IC12.6 45.11,32.3 44.2,32.3 v43.7,32.8 | R34.2 47.3,33 v46.55,33.75
  Top 0.4: IC14.3 47.45,28.15 R32.2 46.9,27.5 R109.2
  Bottom 0.2: v43.7,32.8 45.6,32.8 v46.55,33.75
AUD-AVCC
  Top 0.3: IC25.7 122.93,30.53 C11.1
  Top 0.4: C19.1 C11.1 | 123.3,31.1 C11.1 | R4.2 R5.1 118,33.6 123.2,33.6 123.4,33.4 C11.1
AUD_AMP_FAULT#
  Top 0.2: R7.2 R6.2 128.2,29.88 127.73,29.4 126.8,29.4 | IC25.2 126.18,29.38 126.2,29.4 126.6,29.4 126.8,29.4 | 126.8,29.4 126.8,28.53 IC25.1
AUD_GVDD
  Top 0.2: IC25.10 120.98,29.4 | 120.98,29.4 120.98,29.83 120.8,30 120.8,32 121.1,32.3 121.3,32.3 C12.1 | IC25.9 121.62,29.38 121.6,29.4 120.98,29.4
AUD_IN+
  Top 0.2: IC25.12 119.68,29.58 119.7,29.6 119.7,32.2 C20.2
AUD_IN-
  Top 0.2: IC25.11 120.33,32.78 C21.2
AUDIO-IN
  Top 0.4: J13.2 117.13,36.07 C20.1
AUDIO-PWRON  (via drill 0.3 pad 0.8)
  Top 0.2: Q6.5 85.6,25.4 R13.1 84.9,28.2 85.4,28.7 89,28.7 89.6,29.3 91.7,29.3 92.6,30.2 98.8,30.2 103.3,34.7 103.3,38.9 97.4,44.8 v97.4,45.9 | IC1.90 O14.P$1 T25.P$1 79.6,65 81.3,63.3 81.3,59.1 83.6,56.8 89.9,56.8 91,55.7 93.5,55.7 v93.8,56
  Bottom 0.2: v93.8,56 93.8,53.3 97.4,49.8 v97.4,45.9
AVDD
  Top 0.2: R92.2 80.7,91.8 C56.+ | 82.6,85.7 C55.1
  Top 0.28: IC1.30 82.6,84 82.4,84.2
  Top 0.4: C55.1 82.6,85.9 81.8,86.7 81.8,91.1 | 81.8,91.1 C56.+ | C88.1 82.7,91.1 81.8,91.1
  Top 0.6: 82.4,84.2 82.4,85.5 C55.1
B-  (via drill 0.3 pad 0.7)
  Top 0.4: v48.4,16.2 48.4,22.3 L7.2
  Bottom 0.4: J3.5 52.19,12.5 48.2,12.5 47.5,13.2 47.5,15.7 48,16.2 v48.4,16.2
  Bottom 1: J4.5 67.39,12 55.7,12 54.04,13.67 J3.5
B--
  Top 0.2: R32.1 R31.1 49.8,27.5 R108.2 | IC12.7 45.77,33.54 46.5,32.8 46.5,32.45 IC14.2
  Top 0.4: R32.1 48.4,29.7 47.45,30.65 IC14.2
BSN
  Top 0.2: 122.9,22.9 IC25.22 122.93,21.93 122.8,21.8 122.8,17.9 123.1,17.6 127.5,17.6 127.8,17.9 127.8,19.9 127.5,20.2 126.1,20.2 125.53,20.78 125.53,21.03 | IC25.26 125.53,21.03 | 125.53,21.03 C14.2
BSP
  Top 0.2: IC25.17 119.68,20.9 C13.1 119.2,20.2 117.7,20.2 117.4,19.9 117.4,17.9 117.7,17.6 122.1,17.6 122.4,17.9 122.4,21.8 122.28,21.93 IC25.21
BT-RTS  (via drill 0.3 pad 0.7)
  Top 0.2: J14.7 11.55,90.95 36.5,66 47,66 48.6,64.4 50.4,64.4 v51.1,63.7 | IC1.83 76.1,65.1 72.2,61.2 68.4,61.2 66.4,59.2 64.4,59.2 59.3,54.1 52.1,54.1 v51.8,53.8
  Bottom 0.2: v51.8,53.8 51.8,63 v51.1,63.7
BT-RX  (via drill 0.3 pad 0.7)
  Top 0.2: J14.3 18.51,80.79 35.3,64.2 35.7,63.8 45.2,63.8 v45.6,64.2 | IC1.73 69.1,69.5 68.6,69 68.6,65.6 65,62 63,62 57.9,56.9 47.7,56.9 47.1,56.3 46.3,56.3 v45.6,57
  Bottom 0.2: v45.6,57 v45.6,64.2
BT-TX  (via drill 0.3 pad 0.7)
  Top 0.2: J14.4 16.67,83.33 35.4,64.8 36,64.2 44.1,64.2 v44.4,64.5 | IC1.74 69.2,69 69,68.8 69,65.4 65.2,61.6 63.2,61.6 58.1,56.5 47.9,56.5 47.3,55.9 45.5,55.9 v44.4,57
  Bottom 0.2: v44.4,57 v44.4,64.5
CL_IRQ
  Top 0.2: J5.4 5.7,11.8 4.9,12.6 4.9,15.1 5.7,15.9 5.7,30.8 9.7,34.8 9.7,58.8 13.5,62.6 24.7,62.6 25.4,63.3 27.1,63.3 27.8,62.6 51.9,62.6 54.5,65.2 54.5,76.9 68.9,91.3 75.2,91.3 76.5,90 76.5,85.6 78.1,84 T6.P$1 O18.P$1 IC1.39
CON-LED  (via drill 0.3 pad 0.7)
  Top 0.2: J14.6 13.19,88.41 36.1,65.7 36.8,65 42.6,65 v42.9,65.3 | IC1.78 73.6,65.6 70.8,62.8 67.6,62.8 65.6,60.8 63.6,60.8 58.5,55.7 48.3,55.7 47.7,55.1 44.3,55.1 v42.9,56.5
  Bottom 0.2: v42.9,56.5 v42.9,65.3
CURR-ICB  (via drill 0.3 pad 0.8)
  Top 0.2: IC1.23 87.7,79.5 88.1,79.1 91.6,79.1 | 91.6,79.1 C38.1 | R36.2 102.2,39.4 96.7,44.9 v96.7,46.8 | 96.2,72 v96.3,72 96,72.3 96,76.4 93.3,79.1 91.6,79.1
  Bottom 0.2: v96.7,46.8 96.7,49.9 91.9,54.6 91.9,62.7 96.3,67.5 v96.3,72
CURR-SENSE  (via drill 0.3 pad 0.8)
  Top 0.2: C66.1 91,74.4 | 91,74.4 90.5,74.9 87.1,74.9 87,75 IC1.14 | 91,74.4 91.8,73.6 v91.8,71.6 | R102.2 100.7,40.3 96,45 v96,45.9
  Bottom 0.2: v91.8,71.6 92.6,71 92.6,64.2 91.5,63.1 91.5,54.4 96,50 v96,45.9
D+  (via drill 0.3 pad 0.7)
  Top 0.2: IC1.57 63.7,77.5 63,78.2 v63,78.6
  Top 0.4: J12.3_D+ 53.9,88.5 53,87.6 53,85.1 53.1,85 53.8,85 54.05,84.75 IC15.3 54.05,83.75 53.3,83 53.3,80.7 v53.4,80.6
  Bottom 0.2: v63,78.6 62.7,78.3 54.8,78.3 53.4,79.7 v53.4,80.6
D-  (via drill 0.3 pad 0.7)
  Top 0.2: IC1.56 64.2,78 63.8,78.4 v63.8,79.5
  Top 0.4: J12.2_D- 54.2,86.5 54.8,85.9 54.8,82.75 54.05,82 IC15.2 54.05,81.65 54.3,81.4 54.3,80.7 v54.8,80.2
  Bottom 0.2: v54.8,80.2 54.8,79.4 55.4,78.8 62.2,78.8 62.9,79.5 v63.8,79.5
DEBUG-RXD-A  (via drill 0.3 pad 0.7)
  Top 0.2: IC26.3 111.15,89.85 111.7,89.3 114.5,89.3 116.9,86.9 116.9,81.7 116.6,81.4 116.6,77.7 116.7,77.6 122.2,77.6 123.9,75.9 123.9,71.4 v123,70.5 | J1.28 137.42,51.58 136.2,52.8 127.7,52.8 v127.4,53.1
  Top 0.4: J18.2 110.3,95.8 111.9,94.2 111.9,91.65 IC26.3
  Bottom 0.2: v127.4,53.1 127.8,53.5 127.8,63.3 125.8,65.3 124.7,65.3 124,66 124,69.5 v123,70.5
DEBUG-TXD-A  (via drill 0.3 pad 0.7)
  Top 0.2: 134.92,51.58 J1.27 134.77,51.9 v127.6,51.9 | IC26.2 111.15,93.15 110.3,92.3 110.3,89.7 111.1,88.9 114.2,88.9 116.5,86.6 116.5,81.9 116.2,81.6 116.2,77.5 116.5,77.2 122,77.2 123.5,75.7 123.5,72.3 v123.1,71.9
  Top 0.4: J18.3 107.76,94.44 108.9,93.3 IC26.2
  Bottom 0.2: v123.1,71.9 123.1,71.7 124.4,70.4 124.4,66.2 124.9,65.7 126,65.7 128.2,63.5 128.2,52.5 v127.6,51.9
DGND  (via drill 0.3 pad 0.7, 0.3 pad 0.8)  (1 unrouted)
  Top 0.2: C63.2 R99.2 | C58.2 C59.2 | C28.2 v44.6,83.2 44.6,84.2 | 47.1,37.5 C86.- 47.1,37.2 47.3,37 R48.1 | R31.2 51.8,28 51.8,28.8 v52.3,29.3 51.1,30.5 C39.2 v51,31.3 | R21.2 81.9,35.7 81.2,35 81.2,31.9 82.7,30.4 84.3,30.4 84.5,30.6 84.5,33.6 85.5,33.6 | C51.2 v89.5,64.2 | 83.7,92 83.7,90.5 83.6,90.4 | IC11.4 40.95,84.2 v40.9,84.2 41.6,84.2 | IC7.7 v47.5,80 | IC11.3 41.6,84.2 | 41.6,84.2 v42.9,84.2 | IC7.1 48.15,84.2 v48.1,84.2 47.5,84.2 | IC7.2 47.5,84.2 | IC7.3 46.85,84.2 | 46.85,84.2 47.5,84.2 | IC7.4 v46.2,84.2 | v46.2,84.2 46.85,84.2 | IC11.1 v42.9,84.2 | v42.9,84.2 44.6,84.2 | 44.6,84.2 v46.2,84.2 | 43.71,30.4 43.7,30.4 v43.6,30.4 | v88.9,87.5 C64.2 | R8.1 126.7,34.5 126.7,35.5 v126.6,35.6 126.6,36.3 R84.1 | R10.2 R12.1 v86.1,21.6 85.6,21.6 85.6,23.4 84.9,23.4 | v21.6,31.2 21.3,31.2 | v21.6,31.2 21.55,31.25 IC17.9 19.45,31.25 IC17.PAD | IC17.21 17.45,33.25 IC17.PAD | IC17.10 18.95,31.75 IC17.PAD | C5.2 v24.3,34.3 | 103.25,21.65 Q10.1 102.9,21.9 v102.4,22.4 C46.2 | 106.85,20.35 Q10.4 104.55,20.35 104.55,19.75 v104.5,19.7 | 106.85,20.35 R83.1 | R70.1 101.1,20.1 | 106.85,20.35 v107.4,19.9 | IC23.3 103.85,25.55 R74.2 104.2,25.1 C45.2 | IC22.3 108.55,25.35 R63.2 107.9,24.4 106.5,24.4 C45.2 | R2.2 v18.2,37.9 | J2.C5 5.41,53.01 | C38.2 88.7,79.9 v88.5,80.1 | IC13.3 87.1,90.3 | C8.2 v114.1,13.3 | IC4.2 83.9,23.4 84.85,23.4 | IC4.1 84.85,23.4 | 84.9,23.4 v84.9,23.6 R13.2 | 84.85,23.4 84.9,23.4 | C71.2 R89.1 | J5.1 3.9,16.1 5.2,16.1 5.2,31 9.3,35.1 9.3,52.4 8.7,53 J2.C5 | 8.4,26.5 10.4,28.5 v10.9,28.5 12.9,28.5 C3.2 | C67.2 v66.6,39.1 | v65.2,32.8 65.2,34.6 | R44.2 65.2,34.5 65.15,34.45 64.95,34.45 | v71.7,41.7 C84.2 v74.4,43.1 | 70.7,24.6 v70.7,26.1
  Top 0.2: v70.8,30.9 C35.2 71,32 71,32.1 | C29.2 79,19.3 v79.3,19 | J2.C5 6.4,64.8 D5.K | J6.3 127.45,91.95 v127.3,91.8 | IC19.3 130.25,46.65 130,46.4 v130,45.6 | IC5.3 123.9,53.4 v124.1,53.2 | C71.2 v129,67.4 | R57.1 126.8,67.5 | 126.8,67.5 127.5,67.5 C71.2 | C94.2 117,91.4 C92.2 v124.6,92.1 | v126.3,90 126.8,89.5 126.8,87.2 127.3,87.2 C91.2 127.08,85.93 IC29.26 | C6.2 v102.9,81.7 v99.2,81.7 C40.2 | C75.2 C27.2 115.7,73.1 111.9,73.1 110,71.19 IC9.4 | IC20.3 130.35,61.75 130,61.4 v130,61.2 | IC24.4 IC24.5 49.3,74.16 49.3,75.1 49.1,75.3 49,75.3 | 49,75.3 49.1,75.4 v49.1,79.2 | 123.7,67.5 126.8,67.5 | C45.2 104.9,22.8 v104.9,22.5 | IC24.6 48.73,75.03 49,75.3 | IC29.20 123.9,82.03 123.9,82.68 | 123.9,82.68 IC29.21 128.12,82.68 128.7,82.1 128.7,80.2 | IC29.23 123.9,83.97 123.9,82.68 | IC29.17 127.18,80.08 C95.2 128.7,80.2 | v129.2,79 129.2,80.2 128.7,80.2 | IC29.9 121.3,82.03 121.3,82.68 IC29.8 118,82.68 v118,84 C96.2 | v118,79.4 C93.2 | v21.6,31.2 21.8,31 C2.2 C77.2 | J21.7 25.56,25.74 v21.6,29.7 | J21.7 J21.8 | J15.7 J15.8 27.34,19.7 25.56,19.7 J21.7
  Top 0.28: IC1.45 75.1,81.3 v75.6,80.8 | v80.1,80.8 79.6,81.3 IC1.36 | IC1.31 v82.1,80.8 | IC1.15 85.4,75.5 v84.9,75 | IC1.75 72,68.5 v72.3,68.2 | C51.2 v90.4,63.4 | 68.8,73.5 IC1.65 v72.3,73.5
  Top 0.3: IC8.10 88,36.1 | R19.2 R21.2 | C24.1 91.4,33 91.4,34.6 R17.2 89.85,36.15 | v72.1,86.3 C48.2 v73,85.4 | v122.6,12.7 C15.2 | C16.2 v122.6,12.7 | v122.6,12.7 v122.6,16.9 | 125.53,29.93 124.88,29.28 IC25.4 124.88,25.83 124.9,25.8 | 125.53,29.93 C11.2 | IC25.8 122.28,26.03 IC25.EP | IC25.19 120.98,25.38 | IC25.24 124.23,25.43 | IC25.3 125.53,29.93 | IC29.11 118.53,80.72 | 118.53,80.72 C93.2 | 118.48,85.28 C96.2 | IC29.11 IC29.18 | IC29.18 126.78,80.72 | 126.78,80.72 C95.2 | v121.3,85.1 121.12,85.28 IC29.4 117.98,85.28 | IC29.11 121.2,80.72 v121.2,80.6 | IC29.18 124,80.72 v124,80.6 | 126.88,85.28 IC29.25 124.12,85.28 v124,85.4 | 126.88,85.28 C91.2 | 118.53,80.72 117.93,80.72 | 126.88,85.28 127.38,85.28 | 126.78,80.72 127.38,80.72
  Top 0.4: IC8.EP 86.9,36.1 86.1,35.3 84,35.3 R19.2 | v85.6,36.8 85.6,36.4 v85.6,36.1 | IC6.2 v71,34.3 v71,33 71,32.1 | R46.1 C35.2 | IC13.3 v86.1,90.4 83.6,90.4 C88.2 v82.8,88.3 | C59.2 v84,94.6 82.6,94.6 82.4,94.4 v82.2,94.4 81.7,94.4 C56.- | 61.5,65.5 60.6,66.4 60.6,72.9 61.6,73.9 | 61.5,65.5 62.1,64.9 63.5,64.9 65.6,67 65.6,70.4 68.7,73.5 68.8,73.5 | 61.5,65.5 C61.2 | 61.6,73.9 62.5,74.8 v64.8,74.8 C47.2 v65.6,73.9 | 61.6,73.9 C60.2 | v50.1,31.5 IC14.1 | C57.2 84.3,88.2 | 84.3,88.2 v84.3,88.3 | C55.2 v82.8,88.3 | v82.8,88.3 84.2,88.3 84.3,88.2 | 83.7,92 C58.2 84.7,93.1 v83.8,92.2 | v85.5,83.1 85.8,83.4 87.5,83.4 89.2,85.2 89.2,87.1 | 89.2,87.1 89.2,87.2 v88.9,87.5 | R8.1 R9.1 126.8,31.2 C11.2 | C19.2 v117.2,31 | J13.1 119.67,35.03 C21.1 | C9.2 129.3,24.5 C1.2 | 125.1,25.6 124.9,25.8 | 128.7,17 C17.2 128.6,20 v127.7,20.9 | 128.7,17 122.7,17 v122.6,16.9 116.5,16.9 C18.2 116.6,20 v117.5,20.9 | 124.23,25.43 124.3,25.5 | v131,11.5 C7.2 131.7,12.1 131.7,13.2 128.7,15.4 128.7,17 | C10.2 v116.7,25.5 | 45,9.1 v45.1,9 44.8,8.7 C44.1 42.5,7.6 41.4,7.6 40.91,7.11 J16.4 | C85.2 50.4,81.9 v50.9,81.4 51.85,81.4 IC15.1 52.35,80.65 v52.4,80.2 | 57.9,32.6 65,32.6 v65.2,32.8 | Q9.4 131.15,72.75 | 131.15,72.75 130.9,73 130.9,74 130.85,74.05 130,74.05 | 131.5,77 135.07,77 J1.7 | R85.1 128.75,74.05 Q9.1 130,74.05 | R88.1 C68.2 129.6,71.2 131.15,72.75 | R44.2 65.2,34.6 R43.1 | R96.2 C62.2 59.05,40.55 IC16.4 60.4,40.45 C63.2 | R40.1 56.8,35.9 57.2,36.3 59.7,36.3 R99.2 | R13.2 84.6,24.5 83.7,25.4 83.7,27.1 v84,27.4 | IC10.2 v81.4,26.9 | v81.4,26.9 v79.8,26.9 | IC23.3 105.4,26.5 C79.2 | v38.8,10.5 37.75,10.5 IC27.1 | 101.1,20.1 101.1,20.4 v100.7,20.8
  Top 0.4: J22.4 37.01,38.39 C87.1 35.6,39.8 IC28.1 | v91.9,68.9 v93.6,67.2 v97.5,63.3 | J18.1 IC26.1 C94.2 | 134,40.1 136.2,40.1 | v92.3,92.7 92,92.4 C81.- 92,88.3 v91.9,88.2 90.4,88.2 89.3,87.1 89.2,87.1 | v125.6,54.5 125.9,54.5 126.3,54.3 126.25,54.25 IC18.3 | 127.9,60.1 IC2.3 | IC7.1 48.15,84.15 v48.1,84.2 | J17.3 96.1,93.1 99.5,89.7 99.5,88.3 100.4,87.4 101.9,87.4 | 101.9,87.4 103,87.4 104.1,86.3 J10.3 | IC3.2 101.9,87.4 | 97.1,60.8 94.9,60.8 93.6,62.1 91.7,62.1 v90.4,63.4 | v97.1,61 97.1,60.8 | 97.1,60.8 103,60.8 104.2,59.6 115.8,59.6 123.7,67.5 | C41.2 47.4,36.3 v47.5,36.2 | 47.3,37 47.3,36.4 v47.5,36.2 | v48.7,36.2 v47.5,36.2 | 43.71,30.4 43.71,30.41 44.2,30.9 45.05,30.9 IC12.5 45.14,29.94 v44.8,29.6 | 130,74.05 v130,74.7 | v130.2,82.6 v128.8,84 | IC10.1 82.35,26.9 v81.4,26.9 | C42.2 12.9,76.6 12,75.7 J14.1 | J9.8 22.7,8.7 27.34,13.34 J15.7 | IC21.3 121.05,60.15 R56.1 120.3,60.6 120.1,60.8 | C97.1 124.4,62.1 | C98.2 130.4,48.8 v130,48.8 | C64.2 v87.2,88.3 v86.5,88.3 C36.2 C64.2
  Top 0.406: 57.9,32.6 57.6,32.6 v57.4,32.8 56.8,33.4 R41.2 R40.1
  Top 0.6: 131.5,77 v130,77 | J1.36 137.52,41.42 136.2,40.1 | 134,40.1 v130,40.1 | J1.3 J1.2 | 126.3,54.3 129.8,54.3 v130,54.1 | v66.3,80.2 66.1,80.4 63.1,80.4 59.55,76.85 v59.55,76.65 59.55,76.55 58,75 58,62.7 56.1,60.8 54,60.8 | 76.1,59.7 75.1,59.7 74.95,59.55 | 74.95,59.55 C76.2 | C53.2 74.5,60 74.95,59.55 | v80.1,86.9 79.7,86.9 C49.2
  Top 0.8: v74.9,68.2 v72.3,68.2 v72.3,73.5 | v88.4,35.4 v88.4,36.1 v88.4,36.8 | v76.4,60.7 C54.- | v77.4,61.5 C52.2 78.3,61.1 76.9,59.7 C54.- | v93.8,32.68 C31.- | C54.- 76.1,59.7 | v80.1,80.8 v82.1,80.8 | v75.6,80.8 v78.1,80.8 | v84.9,75 v84.9,73 v84.9,70.4 | C50.2 91.9,75.8 v92.4,75.3 92.6,75.1 C66.2 92.6,73.5 | 92.6,73.5 C65.2 | v93.2,73.55 92.65,73.55 92.6,73.5 | C9.2 118.4,24.5 118.1,24.8 116.8,24.8 C10.2 | 64.95,34.45 v64.6,34.45 | R15.1 v88.3,27.8 | v97.1,32.2 97.1,33.59 D2.- | v112.4,24.9 112.4,24.7 C72.2 | 116.5,16.9 114.9,16.9 112.6,14.6 112.6,13.4 C8.2 | v84.2,57.9 v90.8,57.9 98.3,57.9 100.2,56 117.1,56 119,57.9 v119,59.7 120.1,60.8 v121.4,62.1 124.4,62.1 125.9,62.1 127.9,60.1 129.1,60.1 v130,59.2 J1.21 | C75.2 v119,73.5 | v126.2,74.8 127.4,74.8 R85.1 | C12.2 C21.1 | R63.2 108.9,25.2 | L12.1 57.9,27.1 v58.9,27.1 v58.9,26.3 58.3,26.3 L12.1
  Top 0.813: v93.8,36.3 C31.-
  Top 1: J19.1 79.2,11.5 79.2,13.6 D1.A 78,14.8 C29.2 75.7,21.6 73.7,21.6 70.7,24.6 C83.2 | C31.- 94.27,33.99 D2.-
  Top 1.2: 88,36.1 IC8.EP 86.5,36.1 86.4,36.2 arc90 86.3,36.3 85.9,36.3 85.9,36.4 | v88.4,36.1 89.8,36.1 89.85,36.15 C30.2 91.16,37.1 C31.- | 82.8,40.8 C23.2 C22.2 82.7,44.55 81.35,45.9 | D7.A 81.35,45.9 | 82.7,44.6 82.7,45.95 | 82.6,45.9 81.35,45.9